# EAGLE schematic T-Bone_V101 (EAGLE 6.5.0)

## Sheet 1 of 10
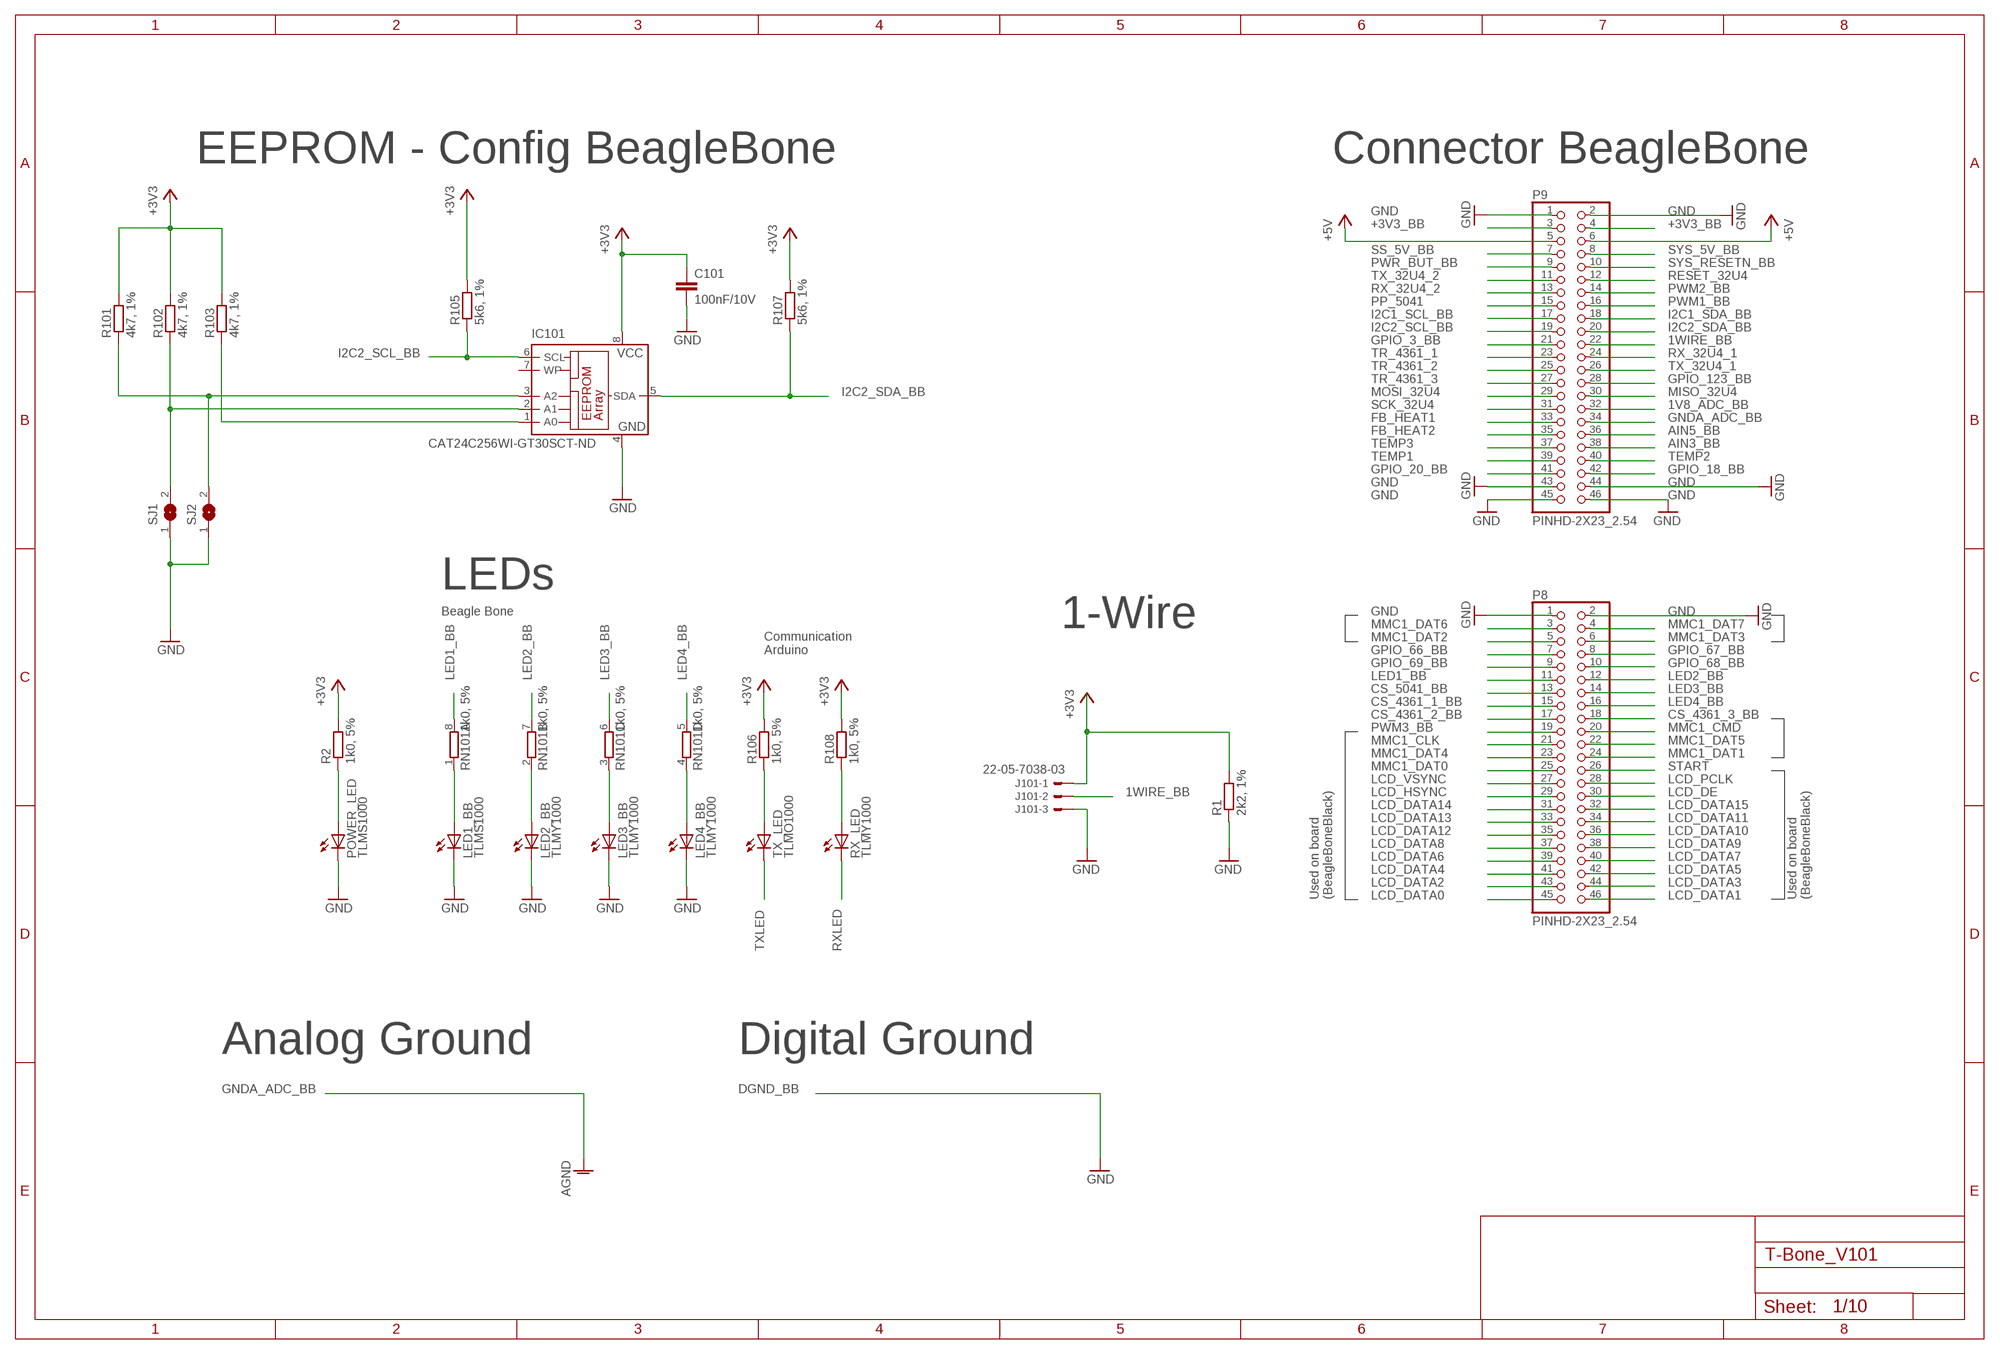
[diagram p0: schematic, sheet 1]

### Parts
C101  100nF/10V  C-EUC0402K  [C0402K]
IC101  CAT24C256WI-GT30SCT-ND  24LC256SN  [SO-08]
J101  22-05-7038-03  [7395-03]
LED1_BB  TLMS1000  LEDCHIP-LED0603  [CHIP-LED0603]
LED2_BB  TLMY1000  LEDCHIP-LED0603  [CHIP-LED0603]
LED3_BB  TLMY1000  LEDCHIP-LED0603  [CHIP-LED0603]
LED4_BB  TLMY1000  LEDCHIP-LED0603  [CHIP-LED0603]
P8  PINHD-2X23_2.54  [2X23]
P9  PINHD-2X23_2.54  [2X23]
POWER_LED  TLMS1000  LEDCHIP-LED0603  [CHIP-LED0603]
R1  2k2, 1%  R-EU_R0603  [R0603]
R2  1k0, 5%  R-EU_R0402  [R0402]
R101  4k7, 1%  R-EU_R0402  [R0402]
R102  4k7, 1%  R-EU_R0402  [R0402]
R103  4k7, 1%  R-EU_R0402  [R0402]
R105  5k6, 1%  R-EU_R0402  [R0402]
R106  1k0, 5%  R-EU_R0402  [R0402]
R107  5k6, 1%  R-EU_R0402  [R0402]
R108  1k0, 5%  R-EU_R0402  [R0402]
RN101  1k0, 5%  4R-NYC124  [YC124]
RX_LED  TLMY1000  LEDCHIP-LED0603  [CHIP-LED0603]
SJ1  SJ  [SJ]
SJ2  SJ  [SJ]
TX_LED  TLMO1000  LEDCHIP-LED0603  [CHIP-LED0603]

### Nets
1V8_ADC_BB: P9.32 ; also sheet 3,10
1WIRE_BB: J101.2 P9.22
+3V3: C101.1 IC101.8(VCC) J101.1 R1.2 R2.2 R101.2 R102.2 R103.2 R105.2 R106.2 R107.2 R108.2 ; also sheet 2,3,4,5,6,7,8,9
+3V3_BB: P9.3 P9.4
+5V: P9.5 P9.6 ; also sheet 2,5,6,7
AIN3_BB: P9.38
AIN5_BB: P9.36
CS_4361_1_BB: P8.15 ; also sheet 8
CS_4361_2_BB: P8.17 ; also sheet 8
CS_4361_3_BB: P8.18 ; also sheet 8
CS_5041_BB: P8.13 ; also sheet 8
FB_HEAT1: P9.33 ; also sheet 3,8
FB_HEAT2: P9.35 ; also sheet 3,8
GND: C101.2 IC101.4(GND) J101.3 LED1_BB.C LED2_BB.C LED3_BB.C LED4_BB.C P8.1 P8.2 P9.1 P9.2 P9.43 P9.44 P9.45 P9.46 POWER_LED.C R1.1 SJ1.1 SJ2.1 ; also sheet 2,3,4,5,6,7,8,9,10
GNDA_ADC_BB: P9.34 ; supply symbol labelled AGND
GPIO_3_BB: P9.21
GPIO_18_BB: P9.42
GPIO_20_BB: P9.41
GPIO_66_BB: P8.7
GPIO_67_BB: P8.8
GPIO_68_BB: P8.10
GPIO_69_BB: P8.9
GPIO_123_BB: P9.28
I2C1_SCL_BB: P9.17
I2C1_SDA_BB: P9.18
I2C2_SCL_BB: IC101.6(SCL) P9.19 R105.1
I2C2_SDA_BB: IC101.5(SDA) P9.20 R107.1
LCD_DATA0: P8.45
LCD_DATA1: P8.46
LCD_DATA2: P8.43
LCD_DATA3: P8.44
LCD_DATA4: P8.41
LCD_DATA5: P8.42
LCD_DATA6: P8.39
LCD_DATA7: P8.40
LCD_DATA8: P8.37
LCD_DATA9: P8.38
LCD_DATA10: P8.36
LCD_DATA11: P8.34
LCD_DATA12: P8.35
LCD_DATA13: P8.33
LCD_DATA14: P8.31
LCD_DATA15: P8.32
LCD_DE: P8.30
LCD_HSYNC: P8.29
LCD_PCLK: P8.28
LCD_VSYNC: P8.27
LED1_BB: P8.11 RN101.8
LED2_BB: P8.12 RN101.7
LED3_BB: P8.14 RN101.6
LED4_BB: P8.16 RN101.5
MISO_32U4: P9.30 ; also sheet 3,4,5,6,7
MMC1_CLK: P8.21
MMC1_CMD: P8.20
MMC1_DAT0: P8.25
MMC1_DAT1: P8.24
MMC1_DAT2: P8.5
MMC1_DAT3: P8.6
MMC1_DAT4: P8.23
MMC1_DAT5: P8.22
MMC1_DAT6: P8.3
MMC1_DAT7: P8.4
MOSI_32U4: P9.29 ; also sheet 3,4,5,6,7
N$28: R106.1 TX_LED.A
N$33: R108.1 RX_LED.A
N$47: POWER_LED.A R2.1
N$88: LED1_BB.A RN101.1
N$90: LED2_BB.A RN101.2
N$91: LED3_BB.A RN101.3
N$92: LED4_BB.A RN101.4
N$107: IC101.2(A1) R102.1 SJ1.2
N$108: IC101.1(A0) R103.1
N$109: IC101.3(A2) R101.1 SJ2.2
PP_5041: P9.15 ; also sheet 4
PWM1_BB: P9.16 ; also sheet 8
PWM2_BB: P9.14 ; also sheet 8
PWM3_BB: P8.19 ; also sheet 8
PWR_BUT_BB: P9.9
RESET_32U4: P9.12 ; also sheet 3
RX_32U4_1: P9.24 ; also sheet 3
RX_32U4_2: P9.13 ; also sheet 3
RXLED: RX_LED.C ; also sheet 3
SCK_32U4: P9.31 ; also sheet 3,4,5,6,7
SS_5V_BB: P9.7
START: P8.26 ; also sheet 3,5,6,7
SYS_5V_BB: P9.8
SYS_RESETN_BB: P9.10
TEMP1: P9.39 ; also sheet 3,10
TEMP2: P9.40 ; also sheet 3,10
TEMP3: P9.37 ; also sheet 3,10
TR_4361_1: P9.23 ; also sheet 5
TR_4361_2: P9.25 ; also sheet 6
TR_4361_3: P9.27 ; also sheet 7
TX_32U4_1: P9.26 ; also sheet 3
TX_32U4_2: P9.11 ; also sheet 3
TXLED: TX_LED.C ; also sheet 3
Unconnected: IC101.7(WP)

### Notes on the sheet
- EEPROM - Config BeagleBone | Connector BeagleBone
- LEDs
- Beagle Bone
- 1-Wire
- Communication
  Arduino
- Used on board
  (BeagleBoneBlack)
- Used on board
  (BeagleBoneBlack)
- Analog Ground | Digital Ground

## Sheet 2 of 10
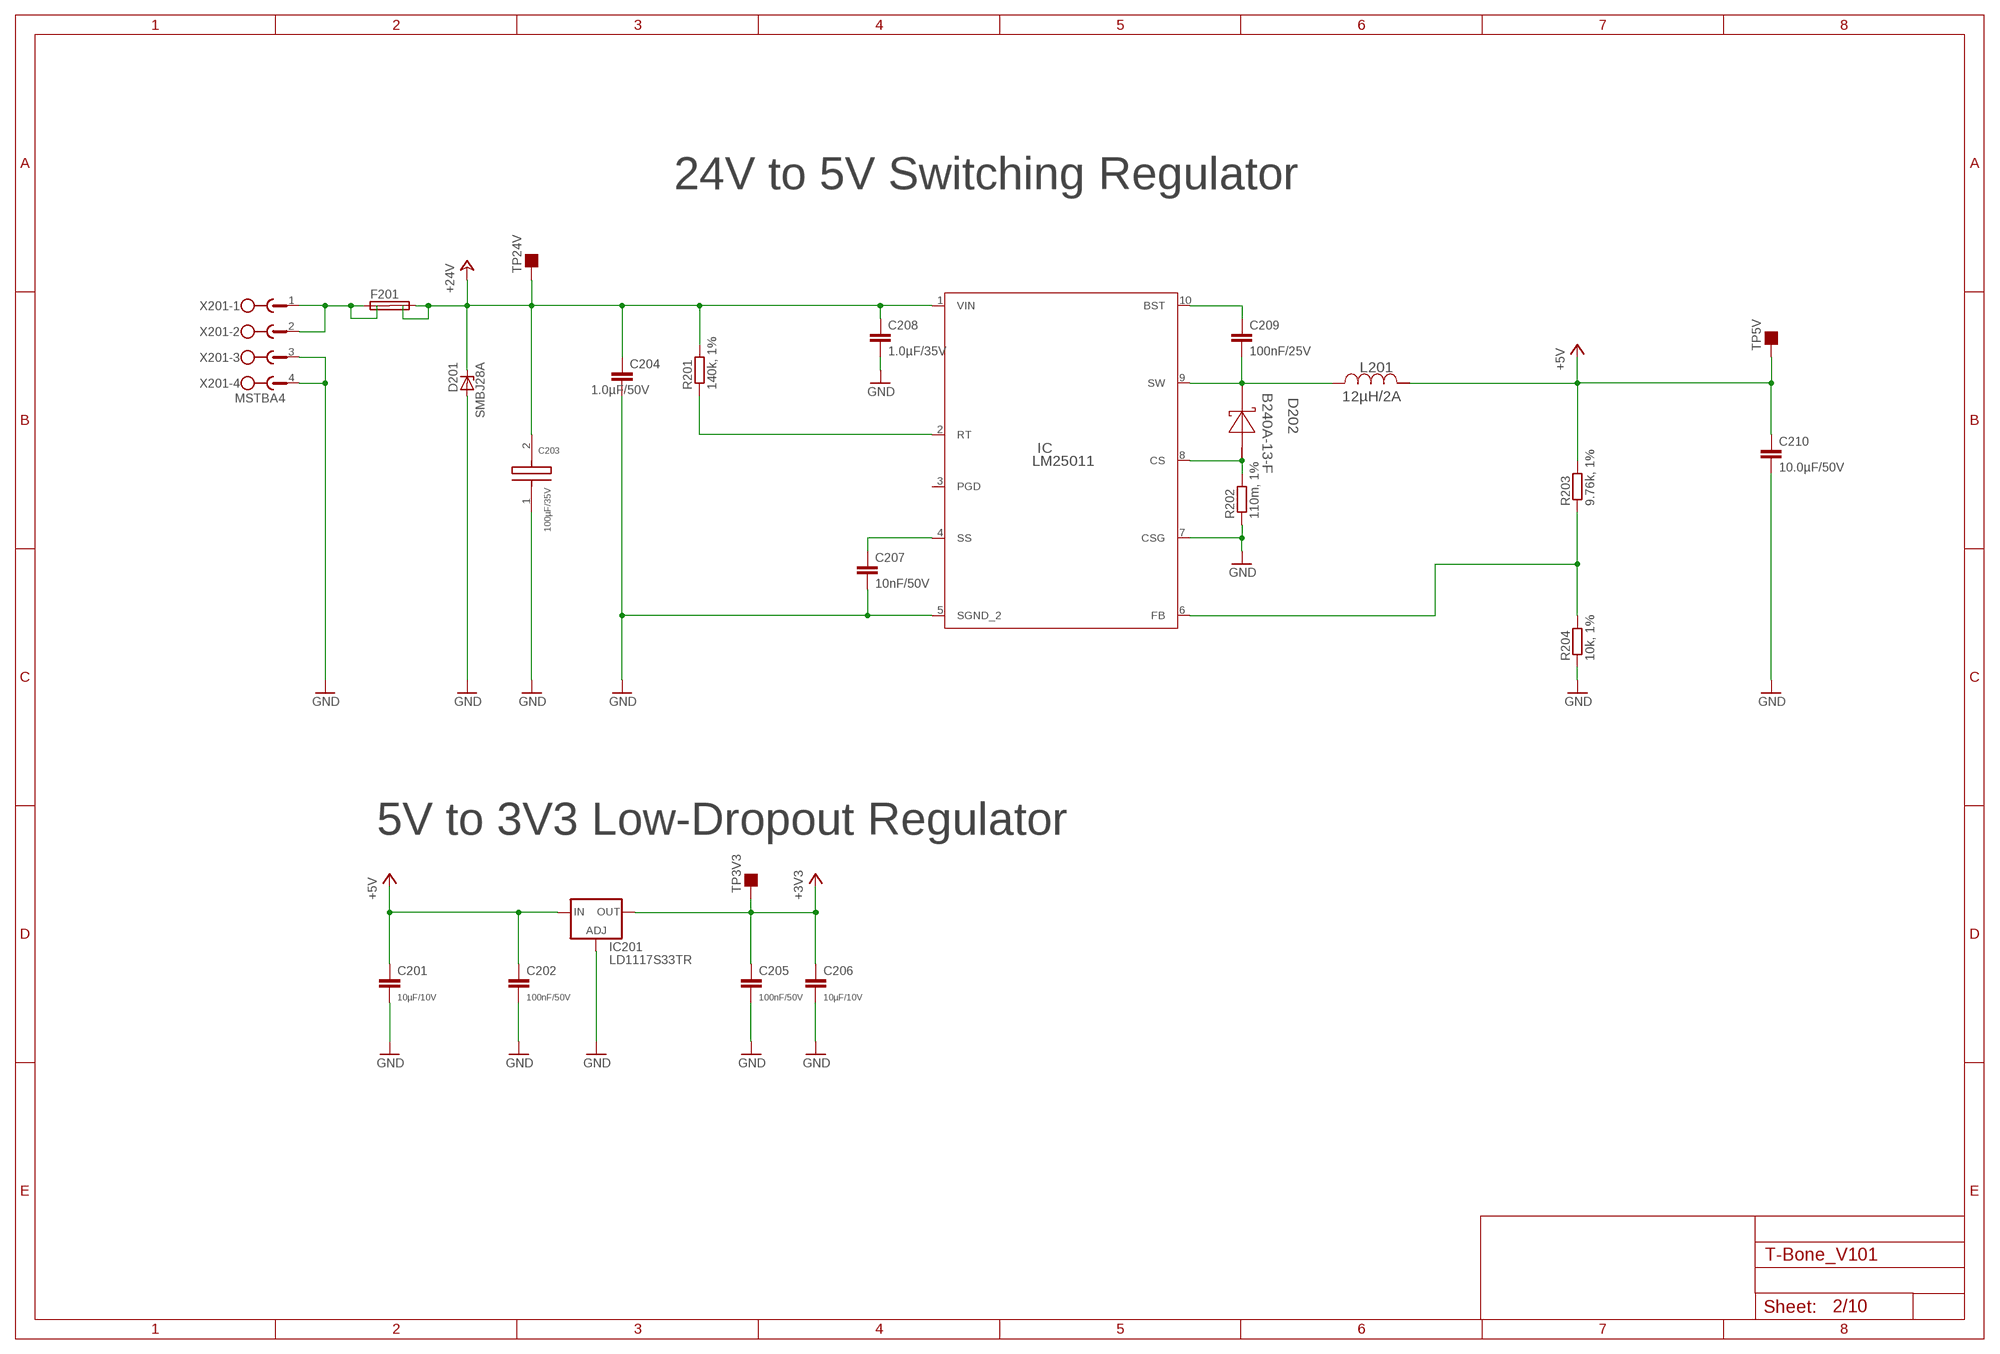
[diagram p1: schematic, sheet 2]

### Parts
C201  10µF/10V  C-EUC0805K  [C0805K]
C202  100nF/50V  C-EUC0603K  [C0603K]
C203  100µF/35V  D8F  [F]
C204  1.0µF/50V  C-EUC1206K  [C1206K]
C205  100nF/50V  C-EUC0603K  [C0603K]
C206  10µF/10V  C-EUC0805K  [C0805K]
C207  10nF/50V  C-EUC0805K  [C0805K]
C208  1.0µF/35V  C-EUC0805K  [C0805K]
C209  100nF/25V  C-EUC0805K  [C0805K]
C210  10.0µF/50V  C-EUC0603K  [C0603K]
D201  SMBJ28A  ZENER-DIODESMB  [SMB]
D202  B240A-13-F  [SMA]
F201  SHK20Q  [SHK20Q]
IC  LM25011  LM25011MY/NOPB  [MUC10A]
IC201  LD1117S33TR  LD117AS33TR  [SOT223]
L201  12µH/2A  SDR0805-120ML  [SDR0805]
R201  140k, 1%  R-EU_R0402  [R0402]
R202  110m, 1%  R-EU_R1210  [R1210]
R203  9.76k, 1%  R-EU_R0402  [R0402]
R204  10k, 1%  R-EU_R0402  [R0402]
TP3V3  TP  [TP]
TP5V  TP  [TP]
TP24V  TP  [TP]
X201  MSTBA4  [MSTBA4]

### Nets
24V_INPUT: F201.1A F201.1B X201.1 X201.2
+3V3: C205.1 C206.1 IC201.4(OUT) TP3V3.P$1 ; also sheet 1,3,4,5,6,7,8,9
+5V: C201.1 C202.1 C210.1 IC201.3(IN) L201.1 R203.2 TP5V.P$1 ; also sheet 1,5,6,7
+24V: C203.2 C204.1 C208.1 D201.C F201.2A F201.2B IC.1(VIN) R201.2 TP24V.P$1 ; also sheet 4,5,6,7,8
GND: C201.2 C202.2 C203.1 C204.2 C205.2 C206.2 C207.2 C208.2 C210.2 D201.A IC201.1(ADJ) IC.5(SGND_2) IC.7(CSG) R202.1 R204.1 X201.3 X201.4 ; also sheet 1,3,4,5,6,7,8,9,10
N$23: D202.2(A) IC.8(CS) R202.2
N$24: C209.2 D202.1(K) IC.9(SW) L201.2
N$85: IC.6(FB) R203.1 R204.2
N$103: C209.1 IC.10(BST)
N$104: C207.1 IC.4(SS)
N$105: IC.2(RT) R201.1
Unconnected: IC.3(PGD)

### Notes on the sheet
- 24V to 5V Switching Regulator
- 5V to 3V3 Low-Dropout Regulator

## Sheet 3 of 10
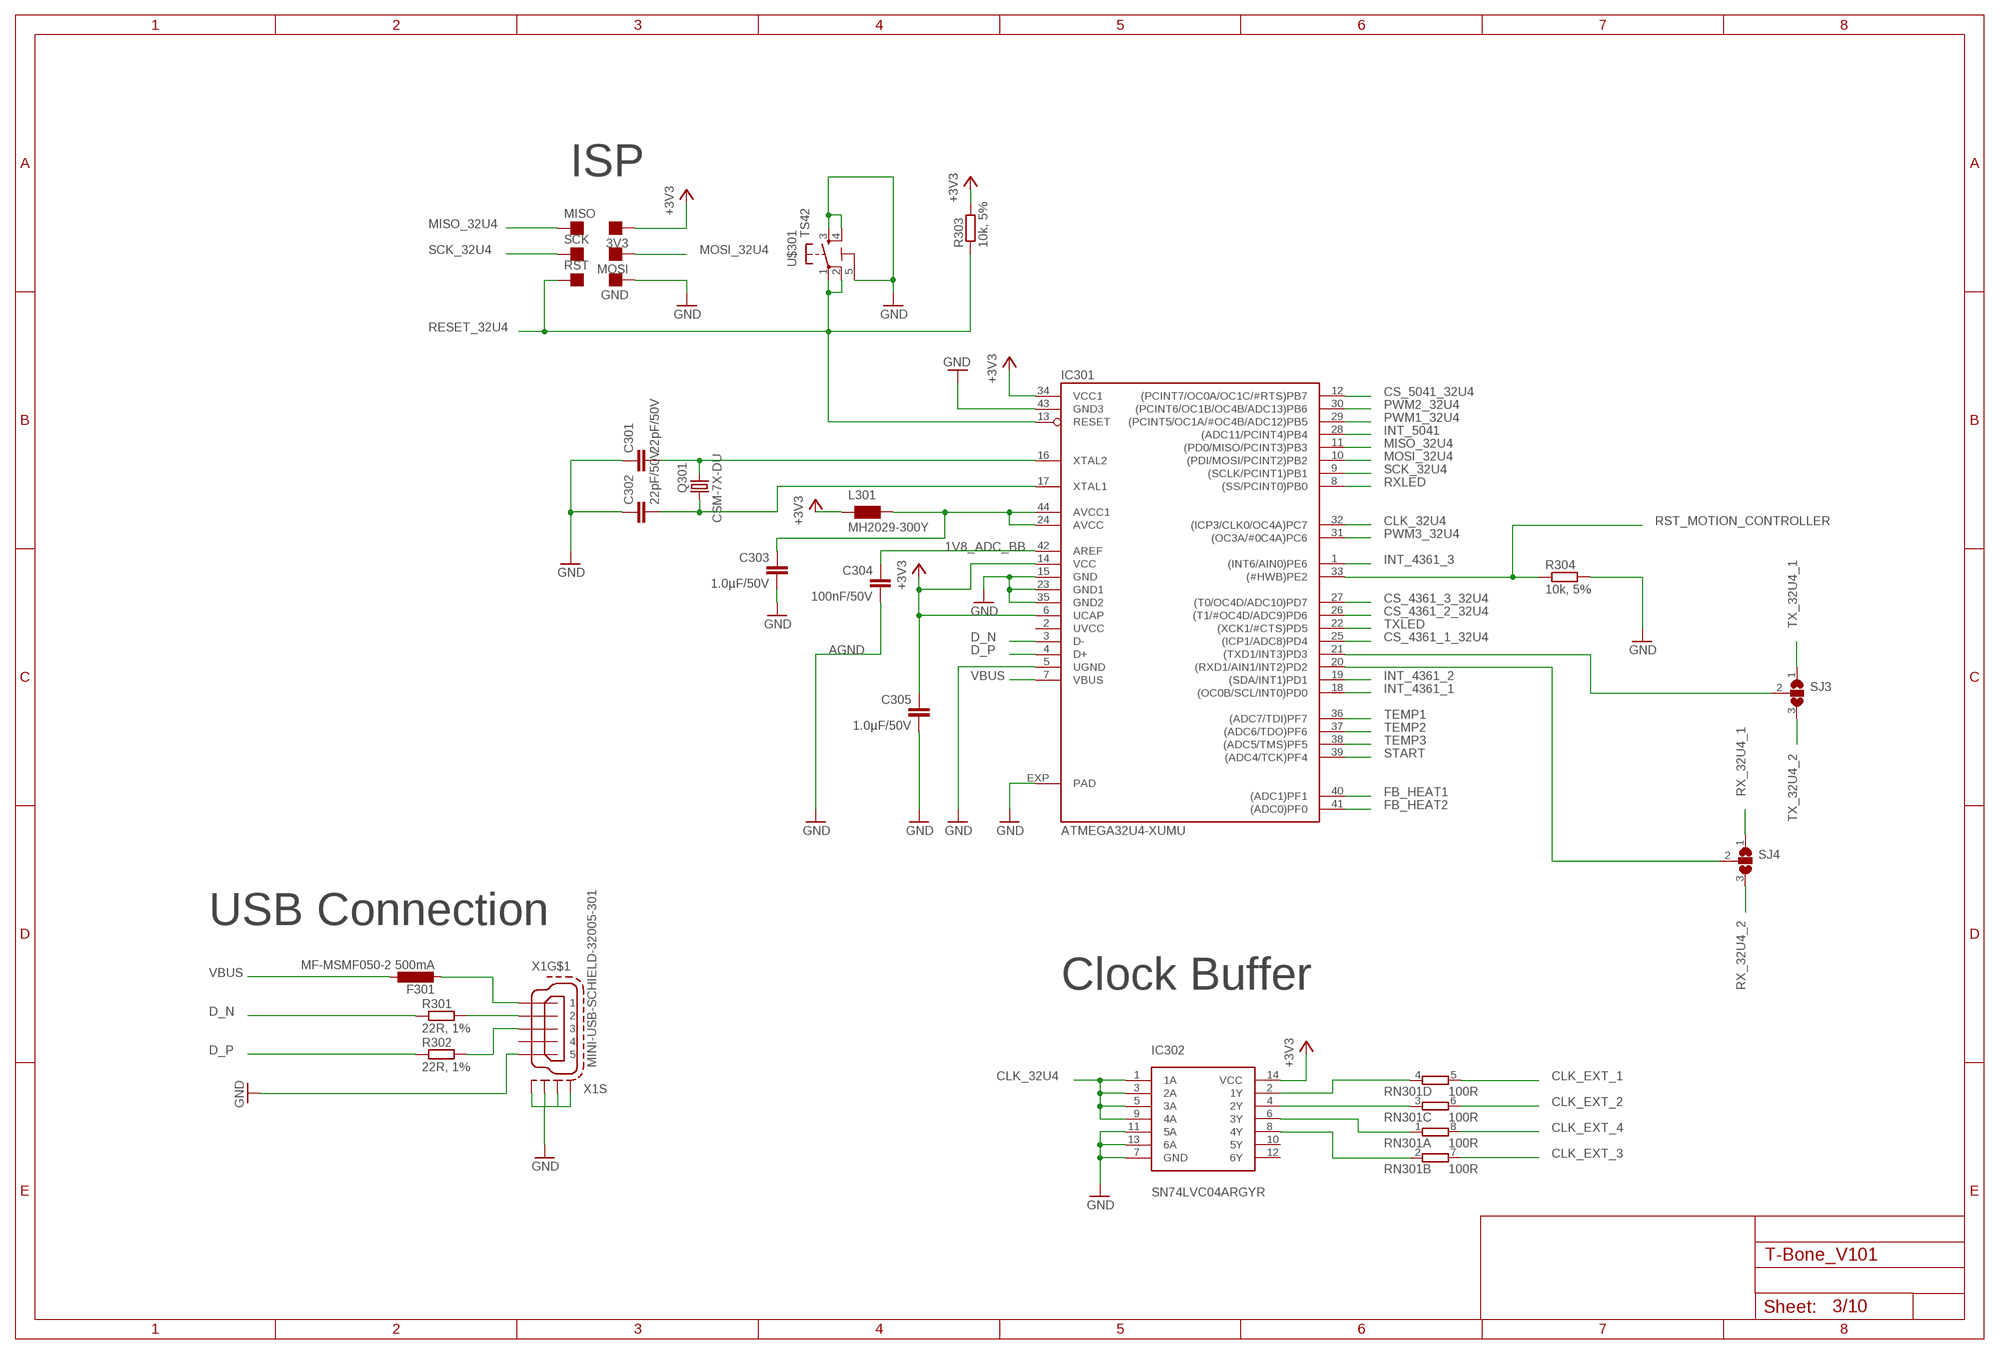
[diagram p2: schematic, sheet 3]

### Parts
3V3  TP  [TP]
C301  22pF/50V  C-EUC0603K  [C0603K]
C302  22pF/50V  C-EUC0603K  [C0603K]
C303  1.0µF/50V  C-EUC0603K  [C0603K]
C304  100nF/50V  C-EUC0603K  [C0603K]
C305  1.0µF/50V  C-EUC0603K  [C0603K]
F301  MF-MSMF050-2 500mA  L-EUL1812  [L1812]
GND  TP  [TP]
IC301  ATMEGA32U4-XUMU  [QFN44ML7X7]
IC302  SN74LVC04ARGYR  74LVC04A  [14-VFQFN]
L301  MH2029-300Y  WE-CBF_0805  [0805]
MISO  TP  [TP]
MOSI  TP  [TP]
Q301  CSM-7X-DU  [CSM-7X-DU]
R301  22R, 1%  R-EU_R0402  [R0402]
R302  22R, 1%  R-EU_R0402  [R0402]
R303  10k, 5%  R-EU_R0603  [R0603]
R304  10k, 5%  R-EU_R0402  [R0402]
RN301  100R  4R-NYC124  [YC124]
RST  TP  [TP]
SCK  TP  [TP]
SJ3  SJ2W  [SJ_2]
SJ4  SJ2W  [SJ_2]
U$301  TS42  [TS42]
X1  MINI-USB-SCHIELD-32005-301  [32005-301]

### Nets
1V8_ADC_BB: C304.1 IC301.42(AREF) ; also sheet 1,10
+3V3: 3V3.P$1 C305.1 IC301.6(UCAP) IC301.14(VCC) IC301.34(VCC1) IC302.14(VCC) L301.1 R303.2 ; also sheet 1,2,4,5,6,7,8,9
AGND: C304.2 ; supply symbol labelled GND
CLK_32U4: IC301.32((ICP3/CLK0/OC4A)PC7) IC302.1(1A) IC302.3(2A) IC302.5(3A) IC302.9(4A)
CLK_EXT_1: RN301.5 ; also sheet 4
CLK_EXT_2: RN301.6 ; also sheet 5
CLK_EXT_3: RN301.7 ; also sheet 6
CLK_EXT_4: RN301.8 ; also sheet 7
CS_4361_1_32U4: IC301.25((ICP1/ADC8)PD4) ; also sheet 8
CS_4361_2_32U4: IC301.26((T1/#OC4D/ADC9)PD6) ; also sheet 8
CS_4361_3_32U4: IC301.27((T0/OC4D/ADC10)PD7) ; also sheet 8
CS_5041_32U4: IC301.12((PCINT7/OC0A/OC1C/#RTS)PB7) ; also sheet 8
D_N: IC301.3(D-) R301.1
D_P: IC301.4(D+) R302.1
FB_HEAT1: IC301.40((ADC1)PF1) ; also sheet 1,8
FB_HEAT2: IC301.41((ADC0)PF0) ; also sheet 1,8
GND: C301.1 C302.1 C303.2 C305.2 GND.P$1 IC301.5(UGND) IC301.15(GND) IC301.23(GND1) IC301.35(GND2) IC301.43(GND3) IC301.EXP(PAD) IC302.7(GND) IC302.11(5A) IC302.13(6A) R304.2 U$301.3 U$301.4 U$301.5(5-GND) X1.5 X1.M1(S:S1) X1.M2(S:S2) X1.M3(S:S3) X1.M4(S:S4) ; also sheet 1,2,4,5,6,7,8,9,10
INT_4361_1: IC301.18((OC0B/SCL/INT0)PD0) ; also sheet 5
INT_4361_2: IC301.19((SDA/INT1)PD1) ; also sheet 6
INT_4361_3: IC301.1((INT6/AIN0)PE6) ; also sheet 7
INT_5041: IC301.28((ADC11/PCINT4)PB4) ; also sheet 4
MISO_32U4: IC301.11((PD0/MISO/PCINT3)PB3) MISO.P$1 ; also sheet 1,4,5,6,7
MOSI_32U4: IC301.10((PDI/MOSI/PCINT2)PB2) MOSI.P$1 ; also sheet 1,4,5,6,7
N$13: IC301.21((TXD1/INT3)PD3) SJ3.2
N$14: R302.2 X1.3
N$15: R301.2 X1.2
N$16: IC302.6(3Y) RN301.1
N$17: IC302.8(4Y) RN301.2
N$18: IC302.2(1Y) RN301.4
N$22: C303.1 IC301.24(AVCC) IC301.44(AVCC1) L301.2
N$25: IC302.4(2Y) RN301.3
N$27: F301.2 X1.1
N$29: C301.2 IC301.16(XTAL2) Q301.2
N$30: C302.2 IC301.17(XTAL1) Q301.1
N$95: IC301.20((RXD1/AIN1/INT2)PD2) SJ4.2
PWM1_32U4: IC301.29((PCINT5/OC1A/#OC4B/ADC12)PB5) ; also sheet 8
PWM2_32U4: IC301.30((PCINT6/OC1B/OC4B/ADC13)PB6) ; also sheet 8
PWM3_32U4: IC301.31((OC3A/#0C4A)PC6) ; also sheet 8
RESET_32U4: IC301.13(RESET) R303.1 RST.P$1 U$301.1 U$301.2 ; also sheet 1
RST_MOTION_CONTROLLER: IC301.33((#HWB)PE2) R304.1 ; also sheet 5,6,7
RX_32U4_1: SJ4.1 ; also sheet 1
RX_32U4_2: SJ4.3 ; also sheet 1
RXLED: IC301.8((SS/PCINT0)PB0) ; also sheet 1
SCK_32U4: IC301.9((SCLK/PCINT1)PB1) SCK.P$1 ; also sheet 1,4,5,6,7
START: IC301.39((ADC4/TCK)PF4) ; also sheet 1,5,6,7
TEMP1: IC301.36((ADC7/TDI)PF7) ; also sheet 1,10
TEMP2: IC301.37((ADC6/TDO)PF6) ; also sheet 1,10
TEMP3: IC301.38((ADC5/TMS)PF5) ; also sheet 1,10
TX_32U4_1: SJ3.1 ; also sheet 1
TX_32U4_2: SJ3.3 ; also sheet 1
TXLED: IC301.22((XCK1/#CTS)PD5) ; also sheet 1
VBUS: F301.1 IC301.7(VBUS)
Unconnected: IC302.10(5Y) IC302.12(6Y) X1.4

### Notes on the sheet
- ISP
- USB Connection
- Clock Buffer

## Sheet 4 of 10
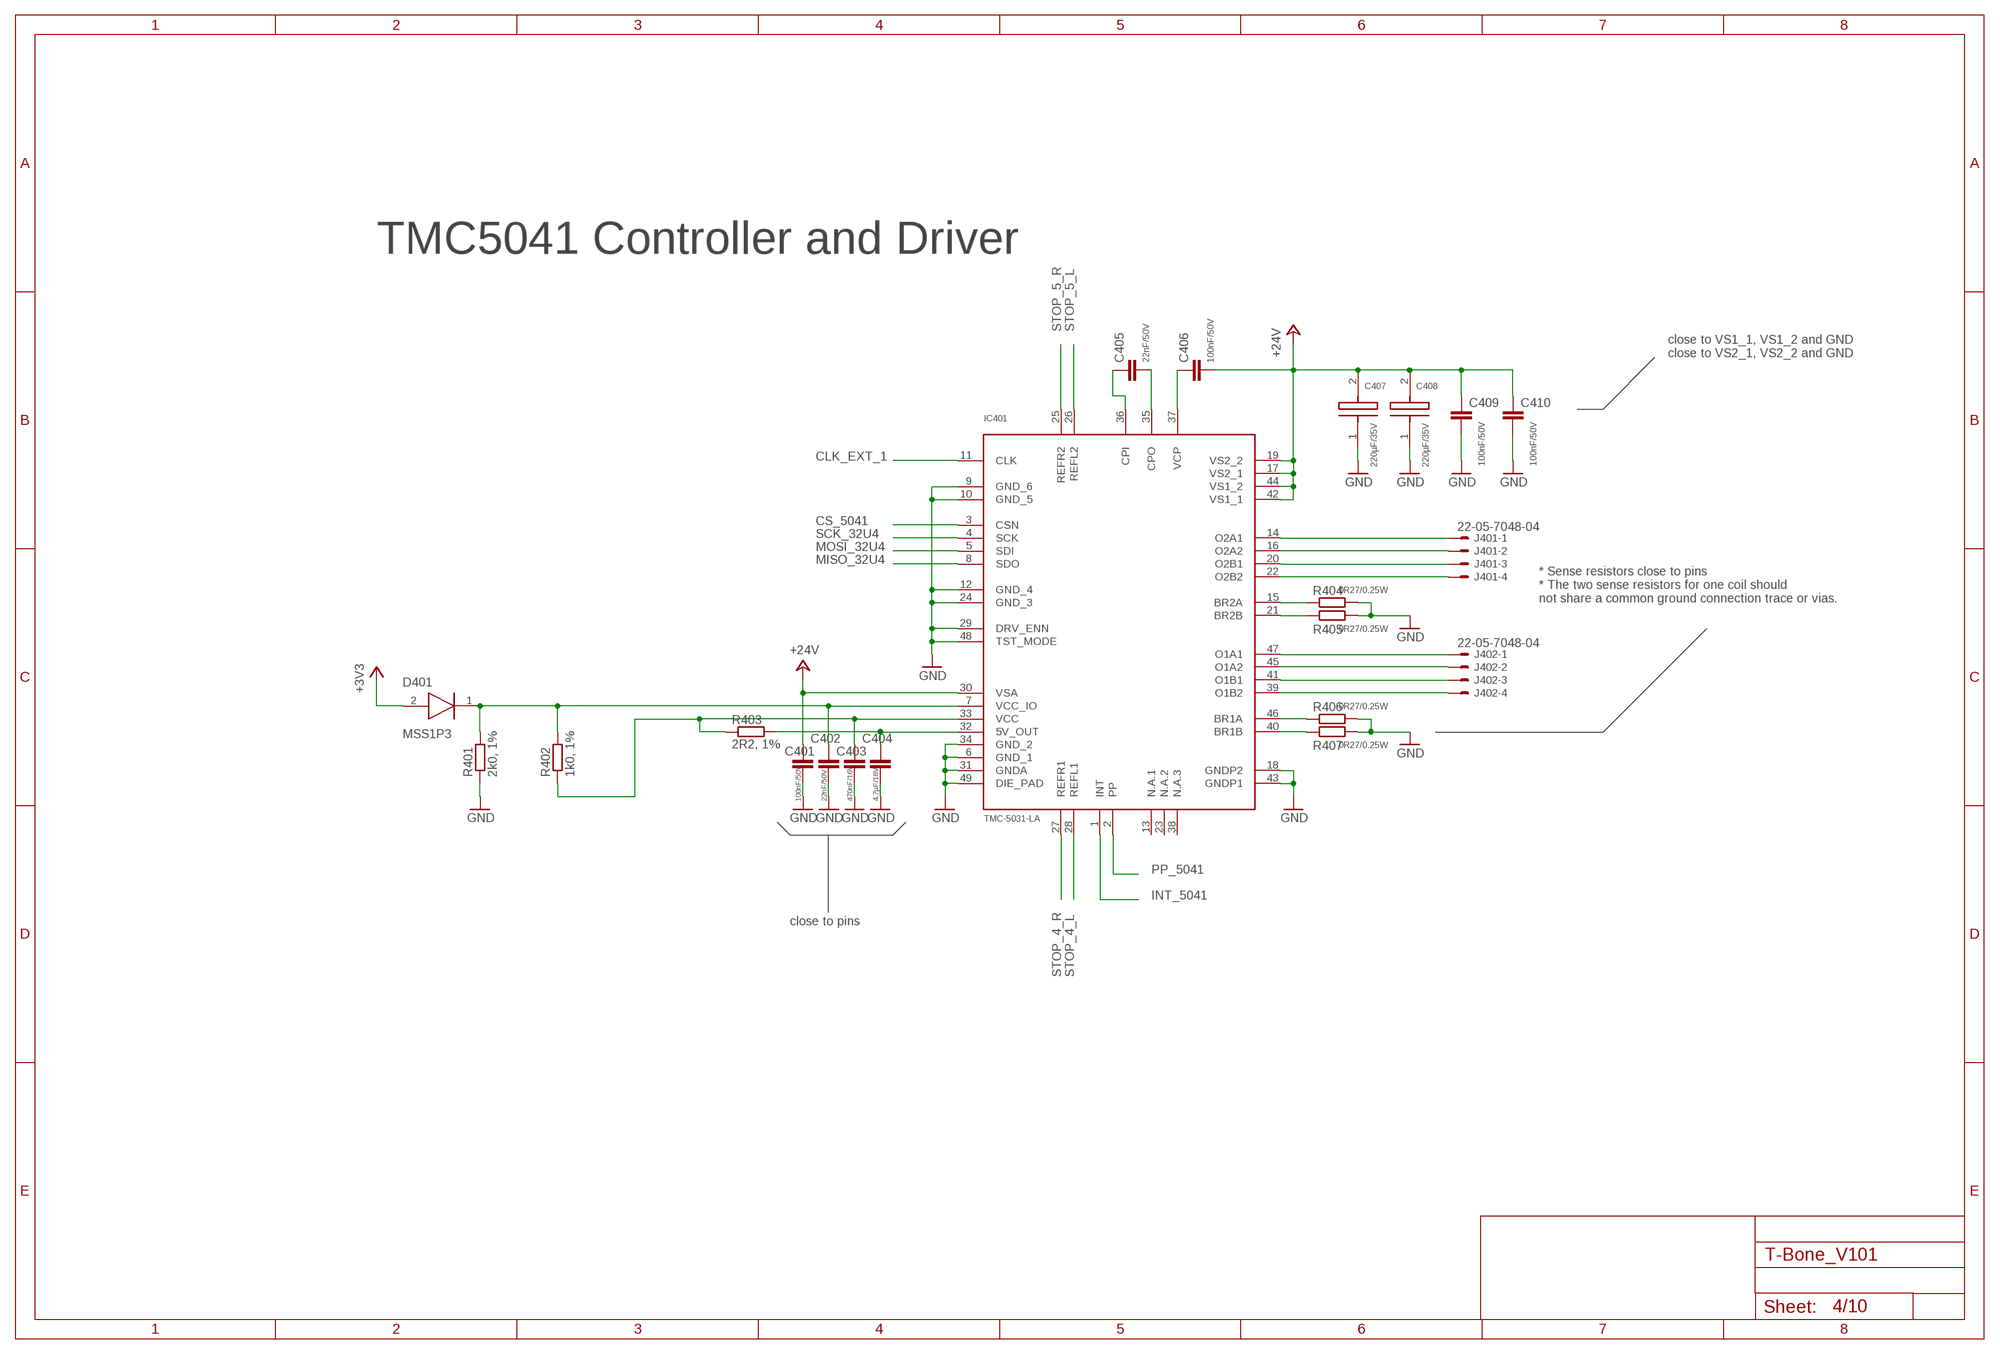
[diagram p3: schematic, sheet 4]

### Parts
C401  100nF/50V  C-EUC0603K  [C0603K]
C402  22nF/50V  C-EUC0603K  [C0603K]
C403  470nF/16V  C-EUC0603K  [C0603K]
C404  4.7µF/16V  C-EUC0603K  [C0603K]
C405  22nF/50V  C-EUC0603K  [C0603K]
C406  100nF/50V  C-EUC0603K  [C0603K]
C407  220µF/35V  D8F  [F]
C408  220µF/35V  D8F  [F]
C409  100nF/50V  C-EUC0603K  [C0603K]
C410  100nF/50V  C-EUC0603K  [C0603K]
D401  MSS1P3  MSS1P6  [MSS1PX]
IC401  TMC-5031-LA  [QFN48]
J401  22-05-7048-04  [7395-04]
J402  22-05-7048-04  [7395-04]
R401  2k0, 1%  R-EU_R0603  [R0603]
R402  1k0, 1%  R-EU_R0603  [R0603]
R403  2R2, 1%  R-EU_R0603  [R0603]
R404  0R27/0.25W  R-EU_R1206  [R1206]
R405  0R27/0.25W  R-EU_R1206  [R1206]
R406  0R27/0.25W  R-EU_R1206  [R1206]
R407  0R27/0.25W  R-EU_R1206  [R1206]

### Nets
5031_O1A1: IC401.47(O1A1) J402.1
5031_O1A2: IC401.45(O1A2) J402.2
5031_O1B1: IC401.41(O1B1) J402.3
5031_O1B2: IC401.39(O1B2) J402.4
5031_O2A1: IC401.14(O2A1) J401.1
5031_O2A2: IC401.16(O2A2) J401.2
5031_O2B1: IC401.20(O2B1) J401.3
5031_O2B2: IC401.22(O2B2) J401.4
+3V3: D401.2(ANODE) ; also sheet 1,2,3,5,6,7,8,9
+24V: C401.1 C406.2 C407.2 C408.2 C409.1 C410.1 IC401.17(VS2_1) IC401.19(VS2_2) IC401.30(VSA) IC401.42(VS1_1) IC401.44(VS1_2) ; also sheet 2,5,6,7,8
CLK_EXT_1: IC401.11(CLK) ; also sheet 3
CS_5041: IC401.3(CSN) ; also sheet 8
GND: C401.2 C402.2 C403.2 C404.2 C407.1 C408.1 C409.2 C410.2 IC401.6(GND_1) IC401.9(GND_6) IC401.10(GND_5) IC401.12(GND_4) IC401.18(GNDP2) IC401.24(GND_3) IC401.29(DRV_ENN) IC401.31(GNDA) IC401.34(GND_2) IC401.43(GNDP1) IC401.48(TST_MODE) IC401.49(DIE_PAD) R401.1 R404.2 R405.2 R406.2 R407.2 ; also sheet 1,2,3,5,6,7,8,9,10
INT_5041: IC401.1(INT) ; also sheet 3
MISO_32U4: IC401.8(SDO) ; also sheet 1,3,5,6,7
MOSI_32U4: IC401.5(SDI) ; also sheet 1,3,5,6,7
N$1: C403.1 IC401.33(VCC) R402.1 R403.1
N$2: C405.2 IC401.35(CPO)
N$3: C405.1 IC401.36(CPI)
N$4: C406.1 IC401.37(VCP)
N$5: C404.1 IC401.32(5V_OUT) R403.2
N$6: IC401.21(BR2B) R405.1
N$7: IC401.15(BR2A) R404.1
N$8: IC401.40(BR1B) R407.1
N$9: IC401.46(BR1A) R406.1
N$57: C402.1 D401.1(KATHODE) IC401.7(VCC_IO) R401.2 R402.2
PP_5041: IC401.2(PP) ; also sheet 1
SCK_32U4: IC401.4(SCK) ; also sheet 1,3,5,6,7
STOP_4_L: IC401.28(REFL1) ; also sheet 9
STOP_4_R: IC401.27(REFR1) ; also sheet 9
STOP_5_L: IC401.26(REFL2) ; also sheet 9
STOP_5_R: IC401.25(REFR2) ; also sheet 9
Unconnected: IC401.13(N.A.1) IC401.23(N.A.2) IC401.38(N.A.3)

### Notes on the sheet
- TMC5041 Controller and Driver
- close to VS1_1, VS1_2 and GND
  close to VS2_1, VS2_2 and GND
- * Sense resistors close to pins
  * The two sense resistors for one coil should
  not share a common ground connection trace or vias.
- close to pins

## Sheet 5 of 10
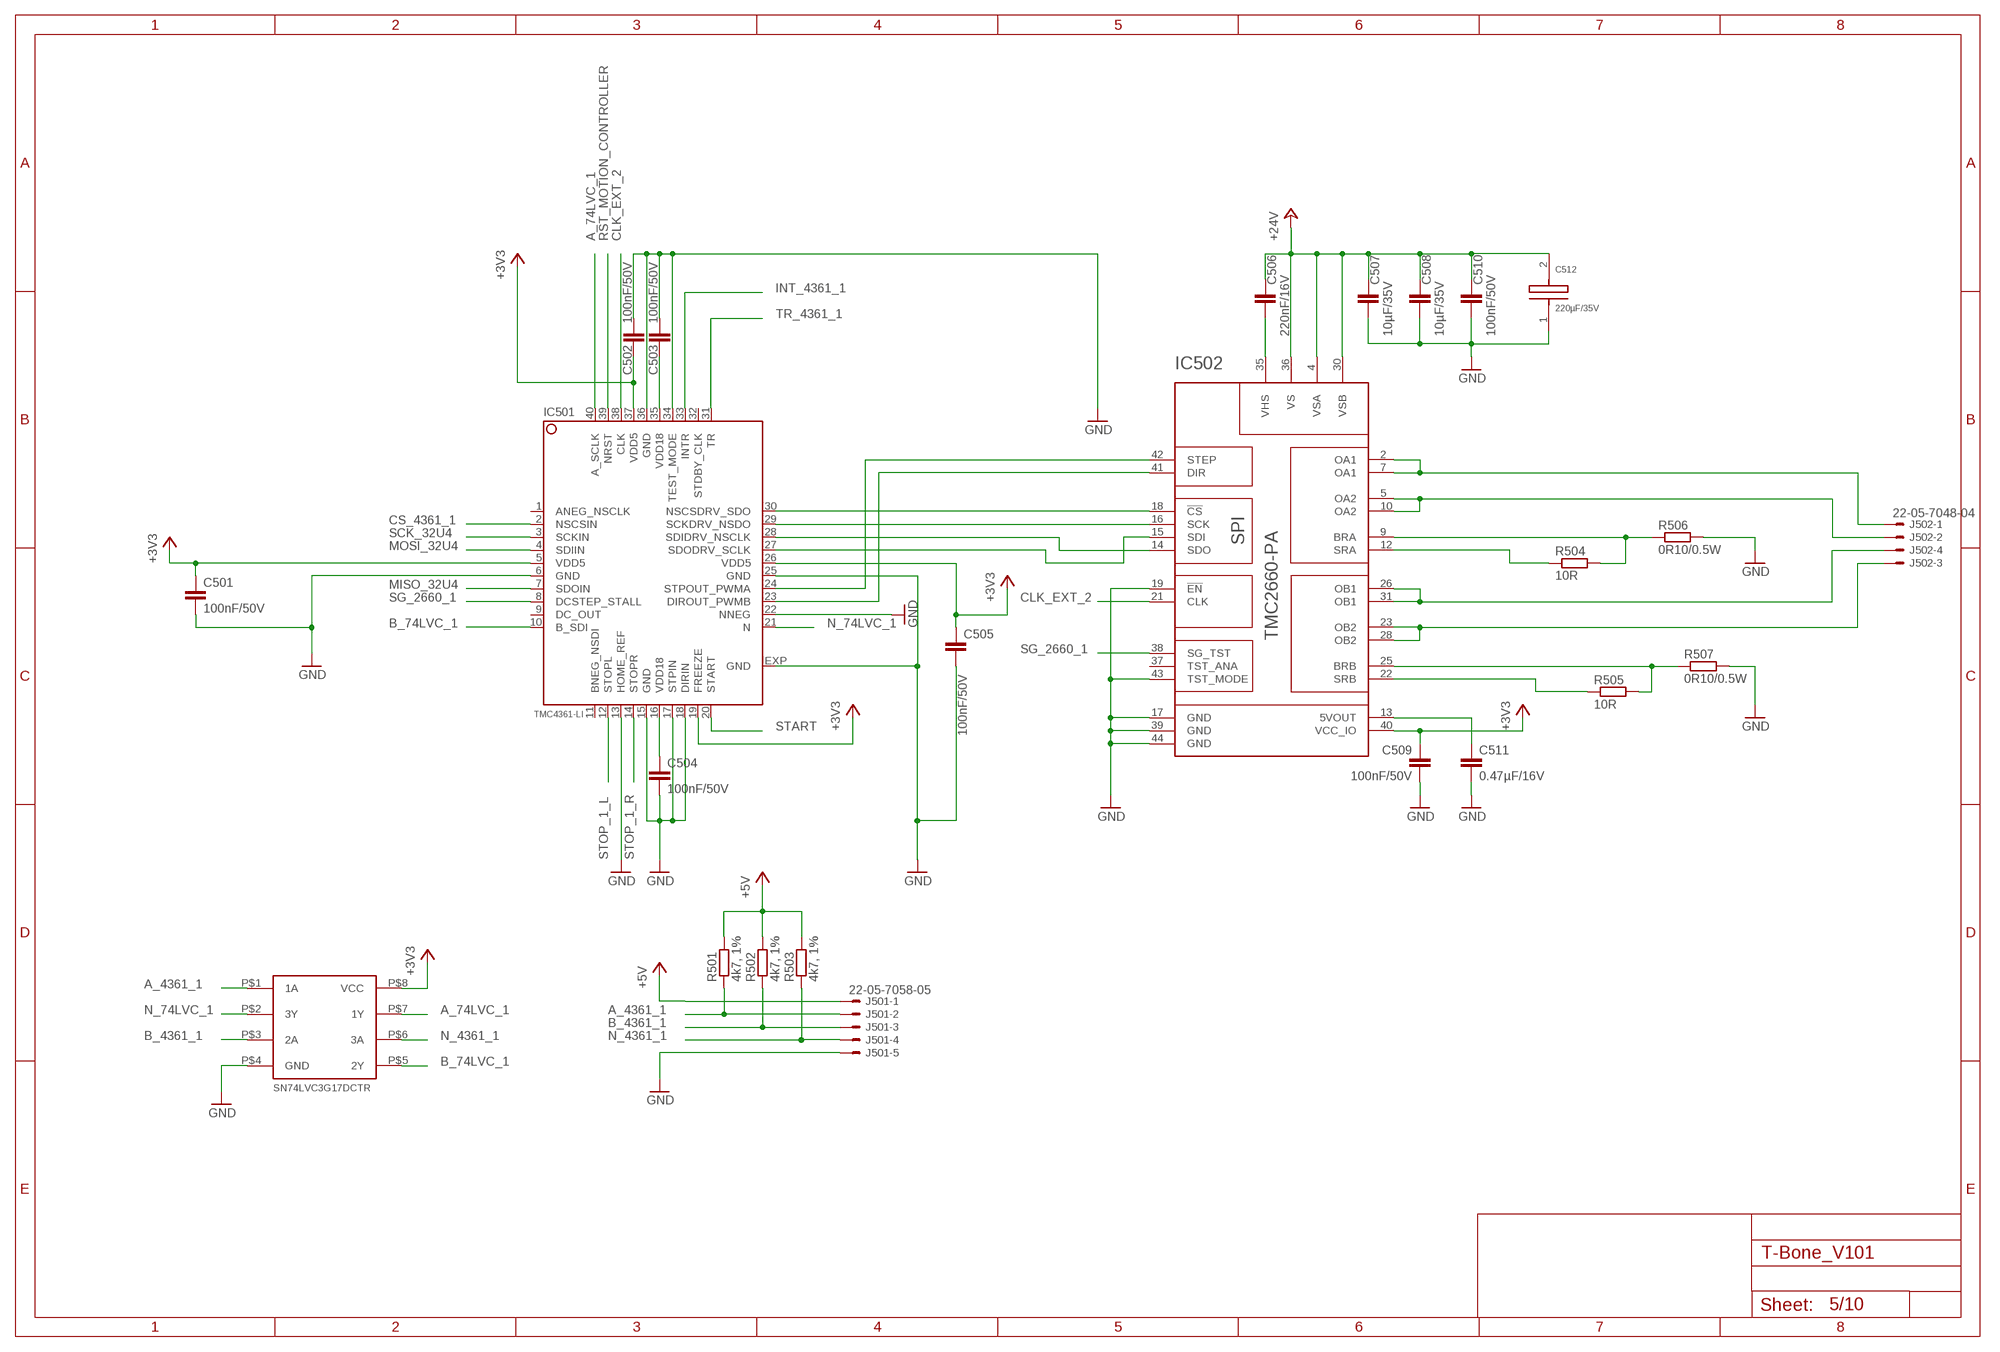
[diagram p4: schematic, sheet 5]

### Parts
C501  100nF/50V  C-EUC0603K  [C0603K]
C502  100nF/50V  C-EUC0603K  [C0603K]
C503  100nF/50V  C-EUC0603K  [C0603K]
C504  100nF/50V  C-EUC0603K  [C0603K]
C505  100nF/50V  C-EUC0603K  [C0603K]
C506  220nF/16V  C-EUC0603K  [C0603K]
C507  10µF/35V  C-EUC1210K  [C1210K]
C508  10µF/35V  C-EUC1210K  [C1210K]
C509  100nF/50V  C-EUC0603K  [C0603K]
C510  100nF/50V  C-EUC0603K  [C0603K]
C511  0.47µF/16V  C-EUC0603K  [C0603K]
C512  220µF/35V  D8F  [F]
IC501  TMC4361-LI  [QFN40L]
IC502  TMC2660-PA  [PQFP44_WITH_PADS]
J501  22-05-7058-05  [7395-05]
J502  22-05-7048-04  [7395-04]
R501  4k7, 1%  R-EU_R0603  [R0603]
R502  4k7, 1%  R-EU_R0603  [R0603]
R503  4k7, 1%  R-EU_R0603  [R0603]
R504  10R  R-EU_R0603  [R0603]
R505  10R  R-EU_R0603  [R0603]
R506  0R10/0.5W  R-EU_R1206  [R1206]
R507  0R10/0.5W  R-EU_R1206  [R1206]
U$501  SN74LVC3G17-SM8  [SN74LVC3G17-SM8]

### Nets
+3V3: C501.1 C502.2 C505.1 C509.1 IC501.5(VDD5) IC501.19(FREEZE) IC501.26(VDD5) IC501.37(VDD5) IC502.40(VCC_IO) U$501.P$8(VCC) ; also sheet 1,2,3,4,6,7,8,9
+5V: J501.1 R501.2 R502.2 R503.2 ; also sheet 1,2,6,7
+24V: C506.1 C507.1 C508.1 C510.1 C512.2 IC502.4(VSA) IC502.30(VSB) IC502.36(VS) ; also sheet 2,4,6,7,8
A_74LVC_1: IC501.40(A_SCLK) U$501.P$7(1Y)
A_4361_1: J501.2 R501.1 U$501.P$1(1A)
B_74LVC_1: IC501.10(B_SDI) U$501.P$5(2Y)
B_4361_1: J501.3 R502.1 U$501.P$3(2A)
CLK_EXT_2: IC501.38(CLK) IC502.21(CLK) ; also sheet 3
CS_4361_1: IC501.2(NSCSIN) ; also sheet 8
GND: C501.2 C502.1 C503.1 C504.2 C505.2 C507.2 C508.2 C509.2 C510.2 C511.2 C512.1 IC501.6(GND) IC501.13(HOME_REF) IC501.15(GND) IC501.17(STPIN) IC501.18(DIRIN) IC501.22(NNEG) IC501.25(GND) IC501.34(TEST_MODE) IC501.36(GND) IC501.EXP(GND) IC502.17(GND) IC502.19(!EN) IC502.39(GND) IC502.43(TST_MODE) IC502.44(GND) J501.5 R506.2 R507.2 U$501.P$4(GND) ; also sheet 1,2,3,4,6,7,8,9,10
IC502_OA1: IC502.2(OA1) IC502.7(OA1) J502.1
IC502_OA2: IC502.5(OA2) IC502.10(OA2) J502.2
IC502_OB1: IC502.26(OB1) IC502.31(OB1) J502.4
IC502_OB2: IC502.23(OB2) IC502.28(OB2) J502.3
INT_4361_1: IC501.33(INTR) ; also sheet 3
MISO_32U4: IC501.7(SDOIN) ; also sheet 1,3,4,6,7
MOSI_32U4: IC501.4(SDIIN) ; also sheet 1,3,4,6,7
N$34: IC501.28(SDIDRV_NSCLK) IC502.14(SDO)
N$35: IC501.27(SDODRV_SCLK) IC502.15(SDI)
N$37: IC501.29(SCKDRV_NSDO) IC502.16(SCK)
N$38: IC501.30(NSCSDRV_SDO) IC502.18(!CS)
N$39: C511.1 IC502.13(5VOUT)
N$40: C506.2 IC502.35(VHS)
N$42: IC502.22(SRB) R505.1
N$43: IC502.25(BRB) R505.2 R507.1
N$44: IC502.12(SRA) R504.1
N$45: IC502.9(BRA) R504.2 R506.1
N$60: IC501.24(STPOUT_PWMA) IC502.42(STEP)
N$61: IC501.23(DIROUT_PWMB) IC502.41(DIR)
N$111: C503.2 IC501.35(VDD18)
N$112: C504.1 IC501.16(VDD18)
N_74LVC_1: IC501.21(N) U$501.P$2(3Y)
N_4361_1: J501.4 R503.1 U$501.P$6(3A)
RST_MOTION_CONTROLLER: IC501.39(NRST) ; also sheet 3,6,7
SCK_32U4: IC501.3(SCKIN) ; also sheet 1,3,4,6,7
SG_2660_1: IC501.8(DCSTEP_STALL) IC502.38(SG_TST)
START: IC501.20(START) ; also sheet 1,3,6,7
STOP_1_L: IC501.12(STOPL) ; also sheet 9
STOP_1_R: IC501.14(STOPR) ; also sheet 9
TR_4361_1: IC501.31(TR) ; also sheet 1
Unconnected: IC501.1(ANEG_NSCLK) IC501.9(DC_OUT) IC501.11(BNEG_NSDI) IC501.32(STDBY_CLK) IC502.37(TST_ANA)

### Notes on the sheet
- SN74LVC3G17DCTR

## Sheet 6 of 10
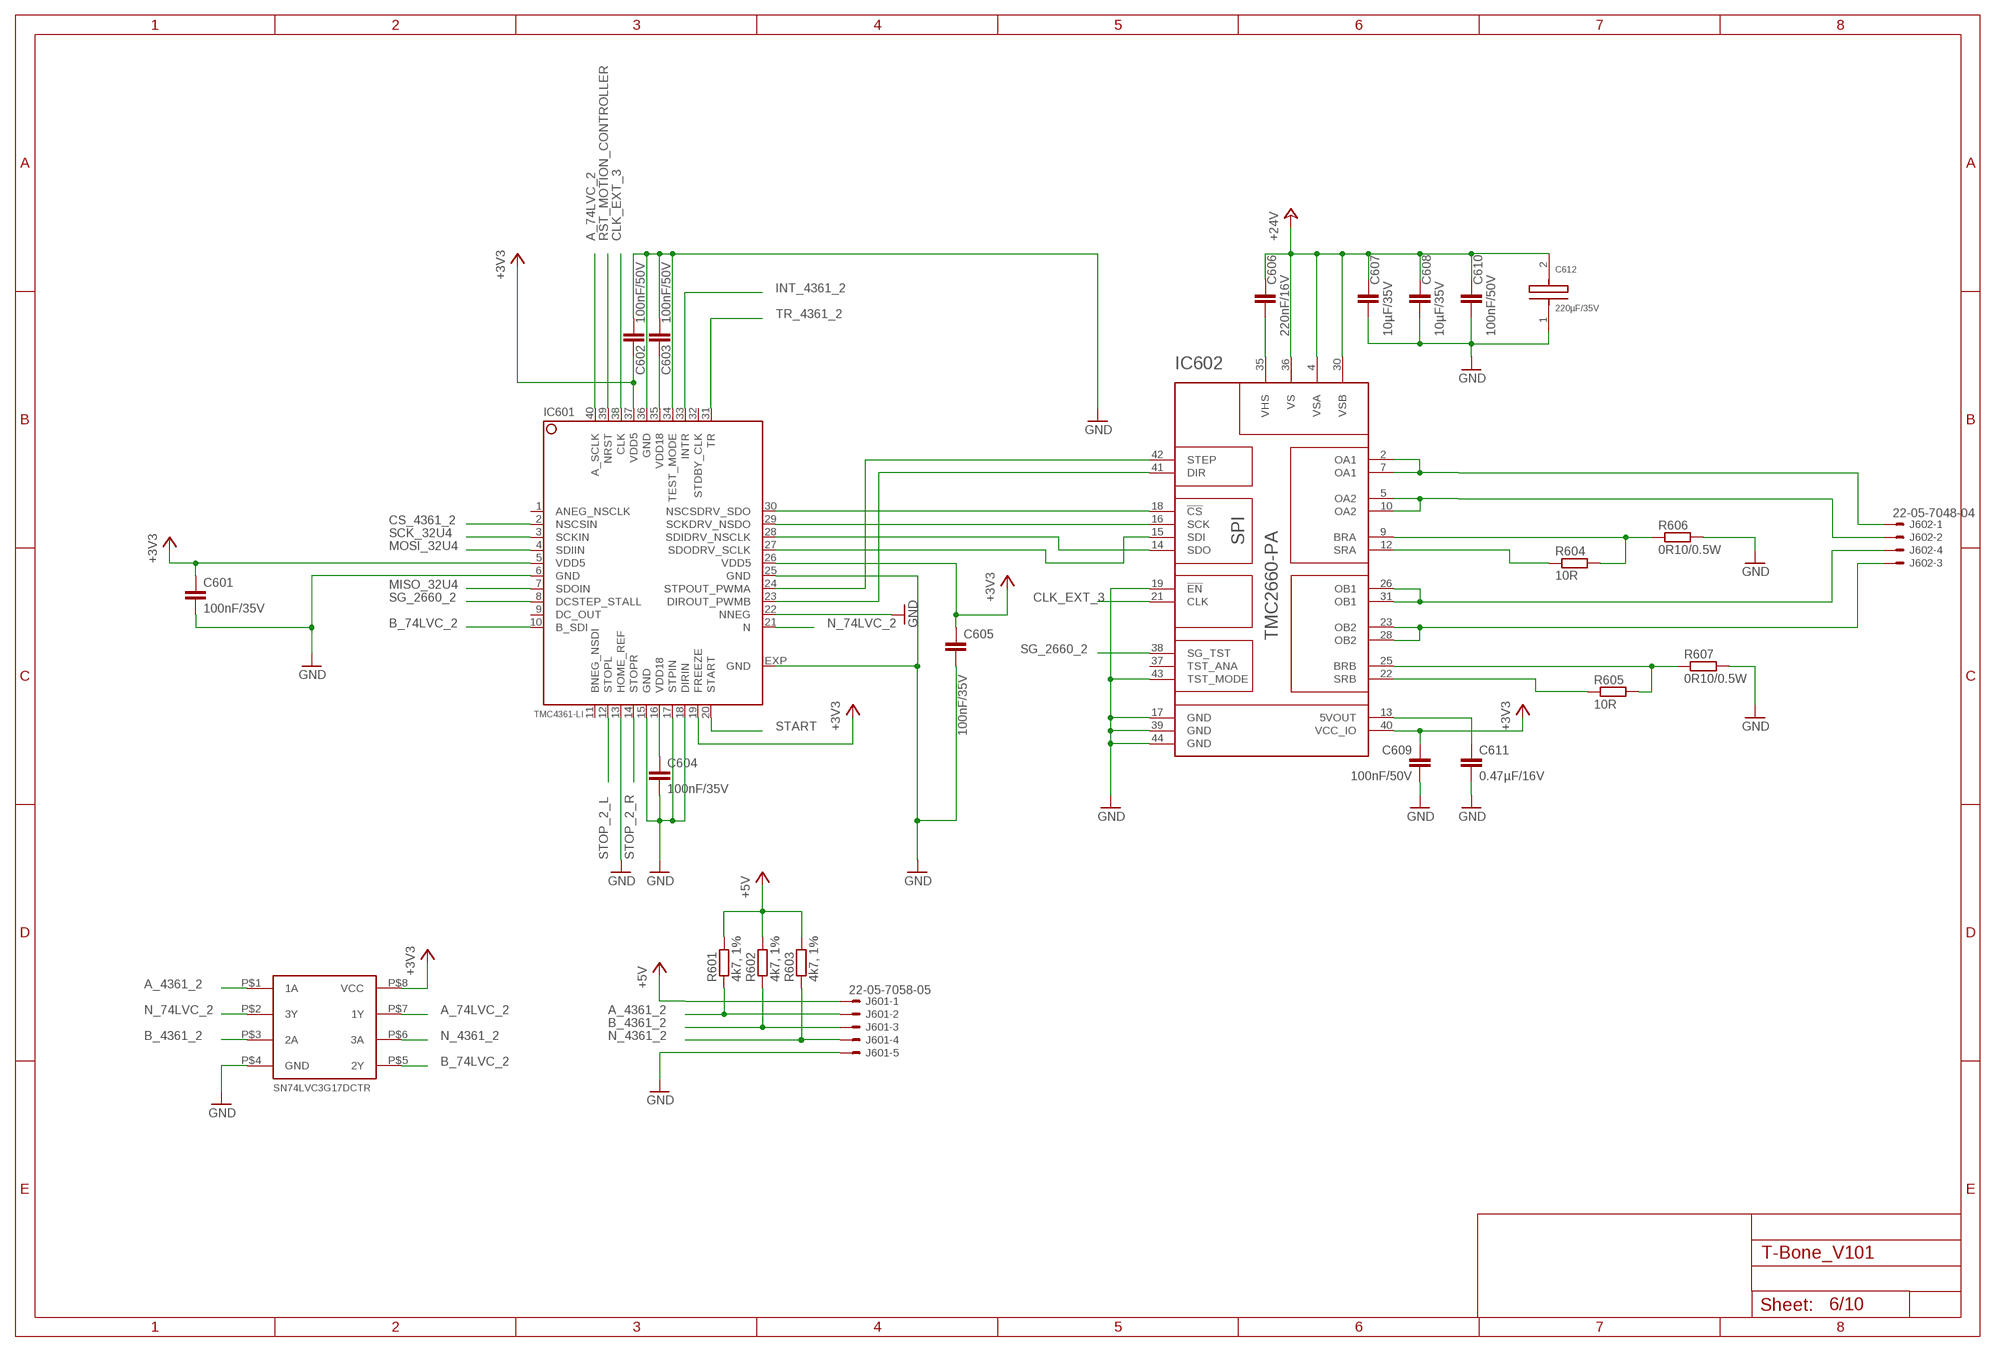
[diagram p5: schematic, sheet 6]

### Parts
C601  100nF/35V  C-EUC0603K  [C0603K]
C602  100nF/50V  C-EUC0603K  [C0603K]
C603  100nF/50V  C-EUC0603K  [C0603K]
C604  100nF/35V  C-EUC0603K  [C0603K]
C605  100nF/35V  C-EUC0603K  [C0603K]
C606  220nF/16V  C-EUC0603K  [C0603K]
C607  10µF/35V  C-EUC1210K  [C1210K]
C608  10µF/35V  C-EUC1210K  [C1210K]
C609  100nF/50V  C-EUC0603K  [C0603K]
C610  100nF/50V  C-EUC0603K  [C0603K]
C611  0.47µF/16V  C-EUC0603K  [C0603K]
C612  220µF/35V  D8F  [F]
IC601  TMC4361-LI  [QFN40L]
IC602  TMC2660-PA  [PQFP44_WITH_PADS]
J601  22-05-7058-05  [7395-05]
J602  22-05-7048-04  [7395-04]
R601  4k7, 1%  R-EU_R0603  [R0603]
R602  4k7, 1%  R-EU_R0603  [R0603]
R603  4k7, 1%  R-EU_R0603  [R0603]
R604  10R  R-EU_R0603  [R0603]
R605  10R  R-EU_R0603  [R0603]
R606  0R10/0.5W  R-EU_R1206  [R1206]
R607  0R10/0.5W  R-EU_R1206  [R1206]
U$601  SN74LVC3G17-SM8  [SN74LVC3G17-SM8]

### Nets
+3V3: C601.1 C602.2 C605.1 C609.1 IC601.5(VDD5) IC601.19(FREEZE) IC601.26(VDD5) IC601.37(VDD5) IC602.40(VCC_IO) U$601.P$8(VCC) ; also sheet 1,2,3,4,5,7,8,9
+5V: J601.1 R601.2 R602.2 R603.2 ; also sheet 1,2,5,7
+24V: C606.1 C607.1 C608.1 C610.1 C612.2 IC602.4(VSA) IC602.30(VSB) IC602.36(VS) ; also sheet 2,4,5,7,8
A_74LVC_2: IC601.40(A_SCLK) U$601.P$7(1Y)
A_4361_2: J601.2 R601.1 U$601.P$1(1A)
B_74LVC_2: IC601.10(B_SDI) U$601.P$5(2Y)
B_4361_2: J601.3 R602.1 U$601.P$3(2A)
CLK_EXT_3: IC601.38(CLK) IC602.21(CLK) ; also sheet 3
CS_4361_2: IC601.2(NSCSIN) ; also sheet 8
GND: C601.2 C602.1 C603.1 C604.2 C605.2 C607.2 C608.2 C609.2 C610.2 C611.2 C612.1 IC601.6(GND) IC601.13(HOME_REF) IC601.15(GND) IC601.17(STPIN) IC601.18(DIRIN) IC601.22(NNEG) IC601.25(GND) IC601.34(TEST_MODE) IC601.36(GND) IC601.EXP(GND) IC602.17(GND) IC602.19(!EN) IC602.39(GND) IC602.43(TST_MODE) IC602.44(GND) J601.5 R606.2 R607.2 U$601.P$4(GND) ; also sheet 1,2,3,4,5,7,8,9,10
IC602_OA1: IC602.2(OA1) IC602.7(OA1) J602.1
IC602_OA2: IC602.5(OA2) IC602.10(OA2) J602.2
IC602_OB1: IC602.26(OB1) IC602.31(OB1) J602.4
IC602_OB2: IC602.23(OB2) IC602.28(OB2) J602.3
INT_4361_2: IC601.33(INTR) ; also sheet 3
MISO_32U4: IC601.7(SDOIN) ; also sheet 1,3,4,5,7
MOSI_32U4: IC601.4(SDIIN) ; also sheet 1,3,4,5,7
N$20: IC601.28(SDIDRV_NSCLK) IC602.14(SDO)
N$21: IC601.27(SDODRV_SCLK) IC602.15(SDI)
N$26: IC601.29(SCKDRV_NSDO) IC602.16(SCK)
N$50: IC602.9(BRA) R604.2 R606.1
N$51: IC602.12(SRA) R604.1
N$54: IC601.30(NSCSDRV_SDO) IC602.18(!CS)
N$55: C606.2 IC602.35(VHS)
N$58: IC601.24(STPOUT_PWMA) IC602.42(STEP)
N$59: IC601.23(DIROUT_PWMB) IC602.41(DIR)
N$62: C611.1 IC602.13(5VOUT)
N$66: IC602.25(BRB) R605.2 R607.1
N$68: IC602.22(SRB) R605.1
N$78: C603.2 IC601.35(VDD18)
N$79: C604.1 IC601.16(VDD18)
N_74LVC_2: IC601.21(N) U$601.P$2(3Y)
N_4361_2: J601.4 R603.1 U$601.P$6(3A)
RST_MOTION_CONTROLLER: IC601.39(NRST) ; also sheet 3,5,7
SCK_32U4: IC601.3(SCKIN) ; also sheet 1,3,4,5,7
SG_2660_2: IC601.8(DCSTEP_STALL) IC602.38(SG_TST)
START: IC601.20(START) ; also sheet 1,3,5,7
STOP_2_L: IC601.12(STOPL) ; also sheet 9
STOP_2_R: IC601.14(STOPR) ; also sheet 9
TR_4361_2: IC601.31(TR) ; also sheet 1
Unconnected: IC601.1(ANEG_NSCLK) IC601.9(DC_OUT) IC601.11(BNEG_NSDI) IC601.32(STDBY_CLK) IC602.37(TST_ANA)

### Notes on the sheet
- SN74LVC3G17DCTR

## Sheet 7 of 10
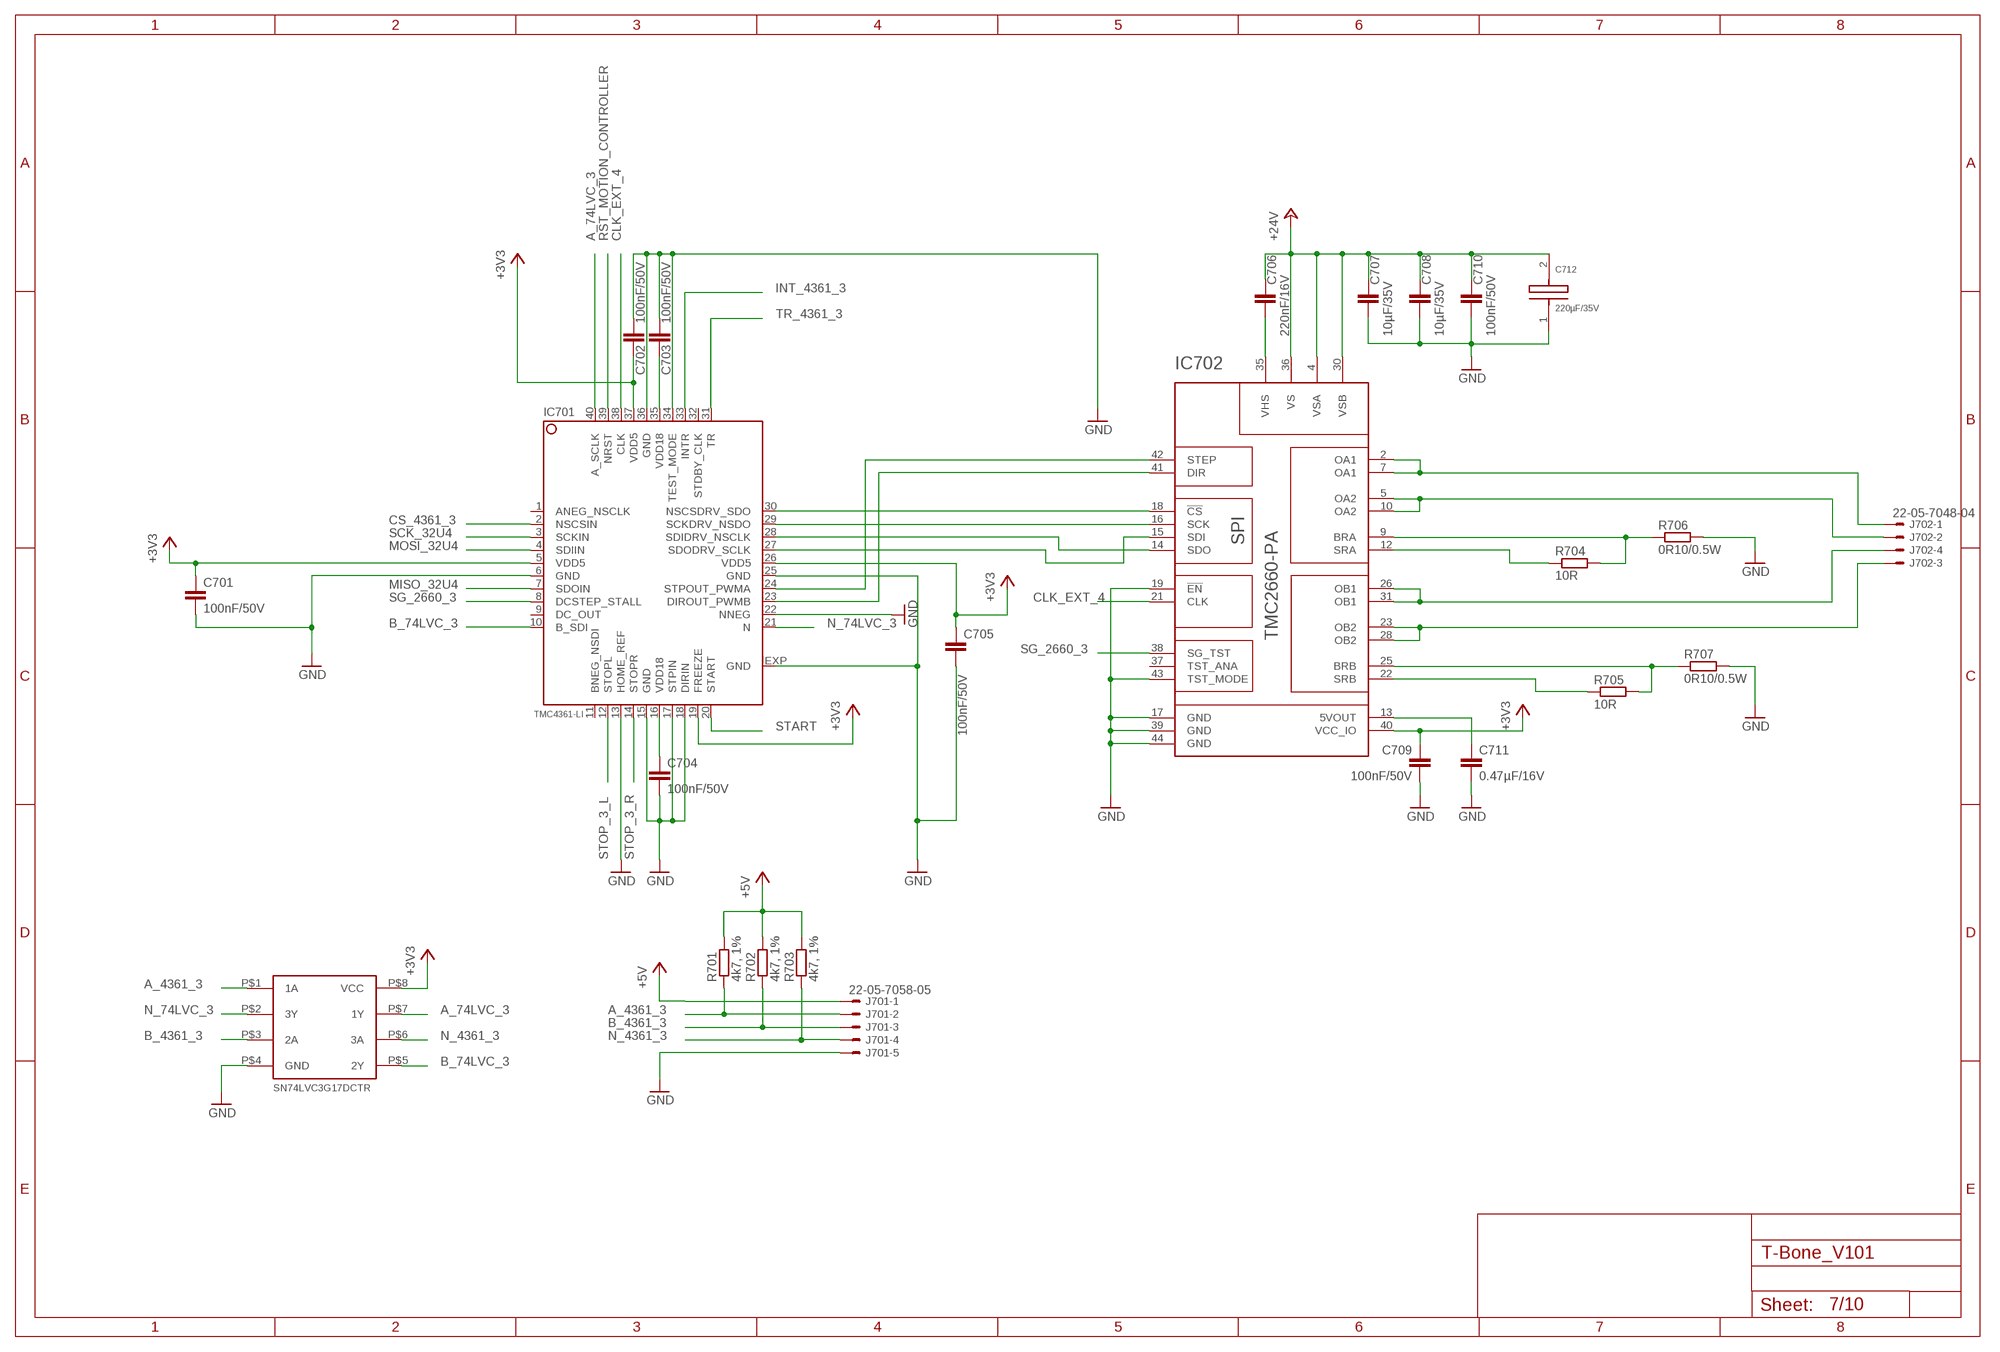
[diagram p6: schematic, sheet 7]

### Parts
C701  100nF/50V  C-EUC0603K  [C0603K]
C702  100nF/50V  C-EUC0603K  [C0603K]
C703  100nF/50V  C-EUC0603K  [C0603K]
C704  100nF/50V  C-EUC0603K  [C0603K]
C705  100nF/50V  C-EUC0603K  [C0603K]
C706  220nF/16V  C-EUC0603K  [C0603K]
C707  10µF/35V  C-EUC1210K  [C1210K]
C708  10µF/35V  C-EUC1210K  [C1210K]
C709  100nF/50V  C-EUC0603K  [C0603K]
C710  100nF/50V  C-EUC0603K  [C0603K]
C711  0.47µF/16V  C-EUC0603K  [C0603K]
C712  220µF/35V  D8F  [F]
IC701  TMC4361-LI  [QFN40L]
IC702  TMC2660-PA  [PQFP44_WITH_PADS]
J701  22-05-7058-05  [7395-05]
J702  22-05-7048-04  [7395-04]
R701  4k7, 1%  R-EU_R0603  [R0603]
R702  4k7, 1%  R-EU_R0603  [R0603]
R703  4k7, 1%  R-EU_R0603  [R0603]
R704  10R  R-EU_R0603  [R0603]
R705  10R  R-EU_R0603  [R0603]
R706  0R10/0.5W  R-EU_R1206  [R1206]
R707  0R10/0.5W  R-EU_R1206  [R1206]
U$701  SN74LVC3G17-SM8  [SN74LVC3G17-SM8]

### Nets
+3V3: C701.1 C702.2 C705.1 C709.1 IC701.5(VDD5) IC701.19(FREEZE) IC701.26(VDD5) IC701.37(VDD5) IC702.40(VCC_IO) U$701.P$8(VCC) ; also sheet 1,2,3,4,5,6,8,9
+5V: J701.1 R701.2 R702.2 R703.2 ; also sheet 1,2,5,6
+24V: C706.1 C707.1 C708.1 C710.1 C712.2 IC702.4(VSA) IC702.30(VSB) IC702.36(VS) ; also sheet 2,4,5,6,8
A_74LVC_3: IC701.40(A_SCLK) U$701.P$7(1Y)
A_4361_3: J701.2 R701.1 U$701.P$1(1A)
B_74LVC_3: IC701.10(B_SDI) U$701.P$5(2Y)
B_4361_3: J701.3 R702.1 U$701.P$3(2A)
CLK_EXT_4: IC701.38(CLK) IC702.21(CLK) ; also sheet 3
CS_4361_3: IC701.2(NSCSIN) ; also sheet 8
GND: C701.2 C702.1 C703.1 C704.2 C705.2 C707.2 C708.2 C709.2 C710.2 C711.2 C712.1 IC701.6(GND) IC701.13(HOME_REF) IC701.15(GND) IC701.17(STPIN) IC701.18(DIRIN) IC701.22(NNEG) IC701.25(GND) IC701.34(TEST_MODE) IC701.36(GND) IC701.EXP(GND) IC702.17(GND) IC702.19(!EN) IC702.39(GND) IC702.43(TST_MODE) IC702.44(GND) J701.5 R706.2 R707.2 U$701.P$4(GND) ; also sheet 1,2,3,4,5,6,8,9,10
IC702_OA1: IC702.2(OA1) IC702.7(OA1) J702.1
IC702_OA2: IC702.5(OA2) IC702.10(OA2) J702.2
IC702_OB1: IC702.26(OB1) IC702.31(OB1) J702.4
IC702_OB2: IC702.23(OB2) IC702.28(OB2) J702.3
INT_4361_3: IC701.33(INTR) ; also sheet 3
MISO_32U4: IC701.7(SDOIN) ; also sheet 1,3,4,5,6
MOSI_32U4: IC701.4(SDIIN) ; also sheet 1,3,4,5,6
N$19: IC701.24(STPOUT_PWMA) IC702.42(STEP)
N$32: IC701.23(DIROUT_PWMB) IC702.41(DIR)
N$36: IC701.28(SDIDRV_NSCLK) IC702.14(SDO)
N$46: IC701.27(SDODRV_SCLK) IC702.15(SDI)
N$63: C711.1 IC702.13(5VOUT)
N$70: IC702.9(BRA) R704.2 R706.1
N$71: IC702.12(SRA) R704.1
N$82: IC701.29(SCKDRV_NSDO) IC702.16(SCK)
N$83: IC701.30(NSCSDRV_SDO) IC702.18(!CS)
N$84: C706.2 IC702.35(VHS)
N$87: IC702.25(BRB) R705.2 R707.1
N$89: IC702.22(SRB) R705.1
N$99: C703.2 IC701.35(VDD18)
N$100: C704.1 IC701.16(VDD18)
N_74LVC_3: IC701.21(N) U$701.P$2(3Y)
N_4361_3: J701.4 R703.1 U$701.P$6(3A)
RST_MOTION_CONTROLLER: IC701.39(NRST) ; also sheet 3,5,6
SCK_32U4: IC701.3(SCKIN) ; also sheet 1,3,4,5,6
SG_2660_3: IC701.8(DCSTEP_STALL) IC702.38(SG_TST)
START: IC701.20(START) ; also sheet 1,3,5,6
STOP_3_L: IC701.12(STOPL) ; also sheet 9
STOP_3_R: IC701.14(STOPR) ; also sheet 9
TR_4361_3: IC701.31(TR) ; also sheet 1
Unconnected: IC701.1(ANEG_NSCLK) IC701.9(DC_OUT) IC701.11(BNEG_NSDI) IC701.32(STDBY_CLK) IC702.37(TST_ANA)

### Notes on the sheet
- SN74LVC3G17DCTR

## Sheet 8 of 10
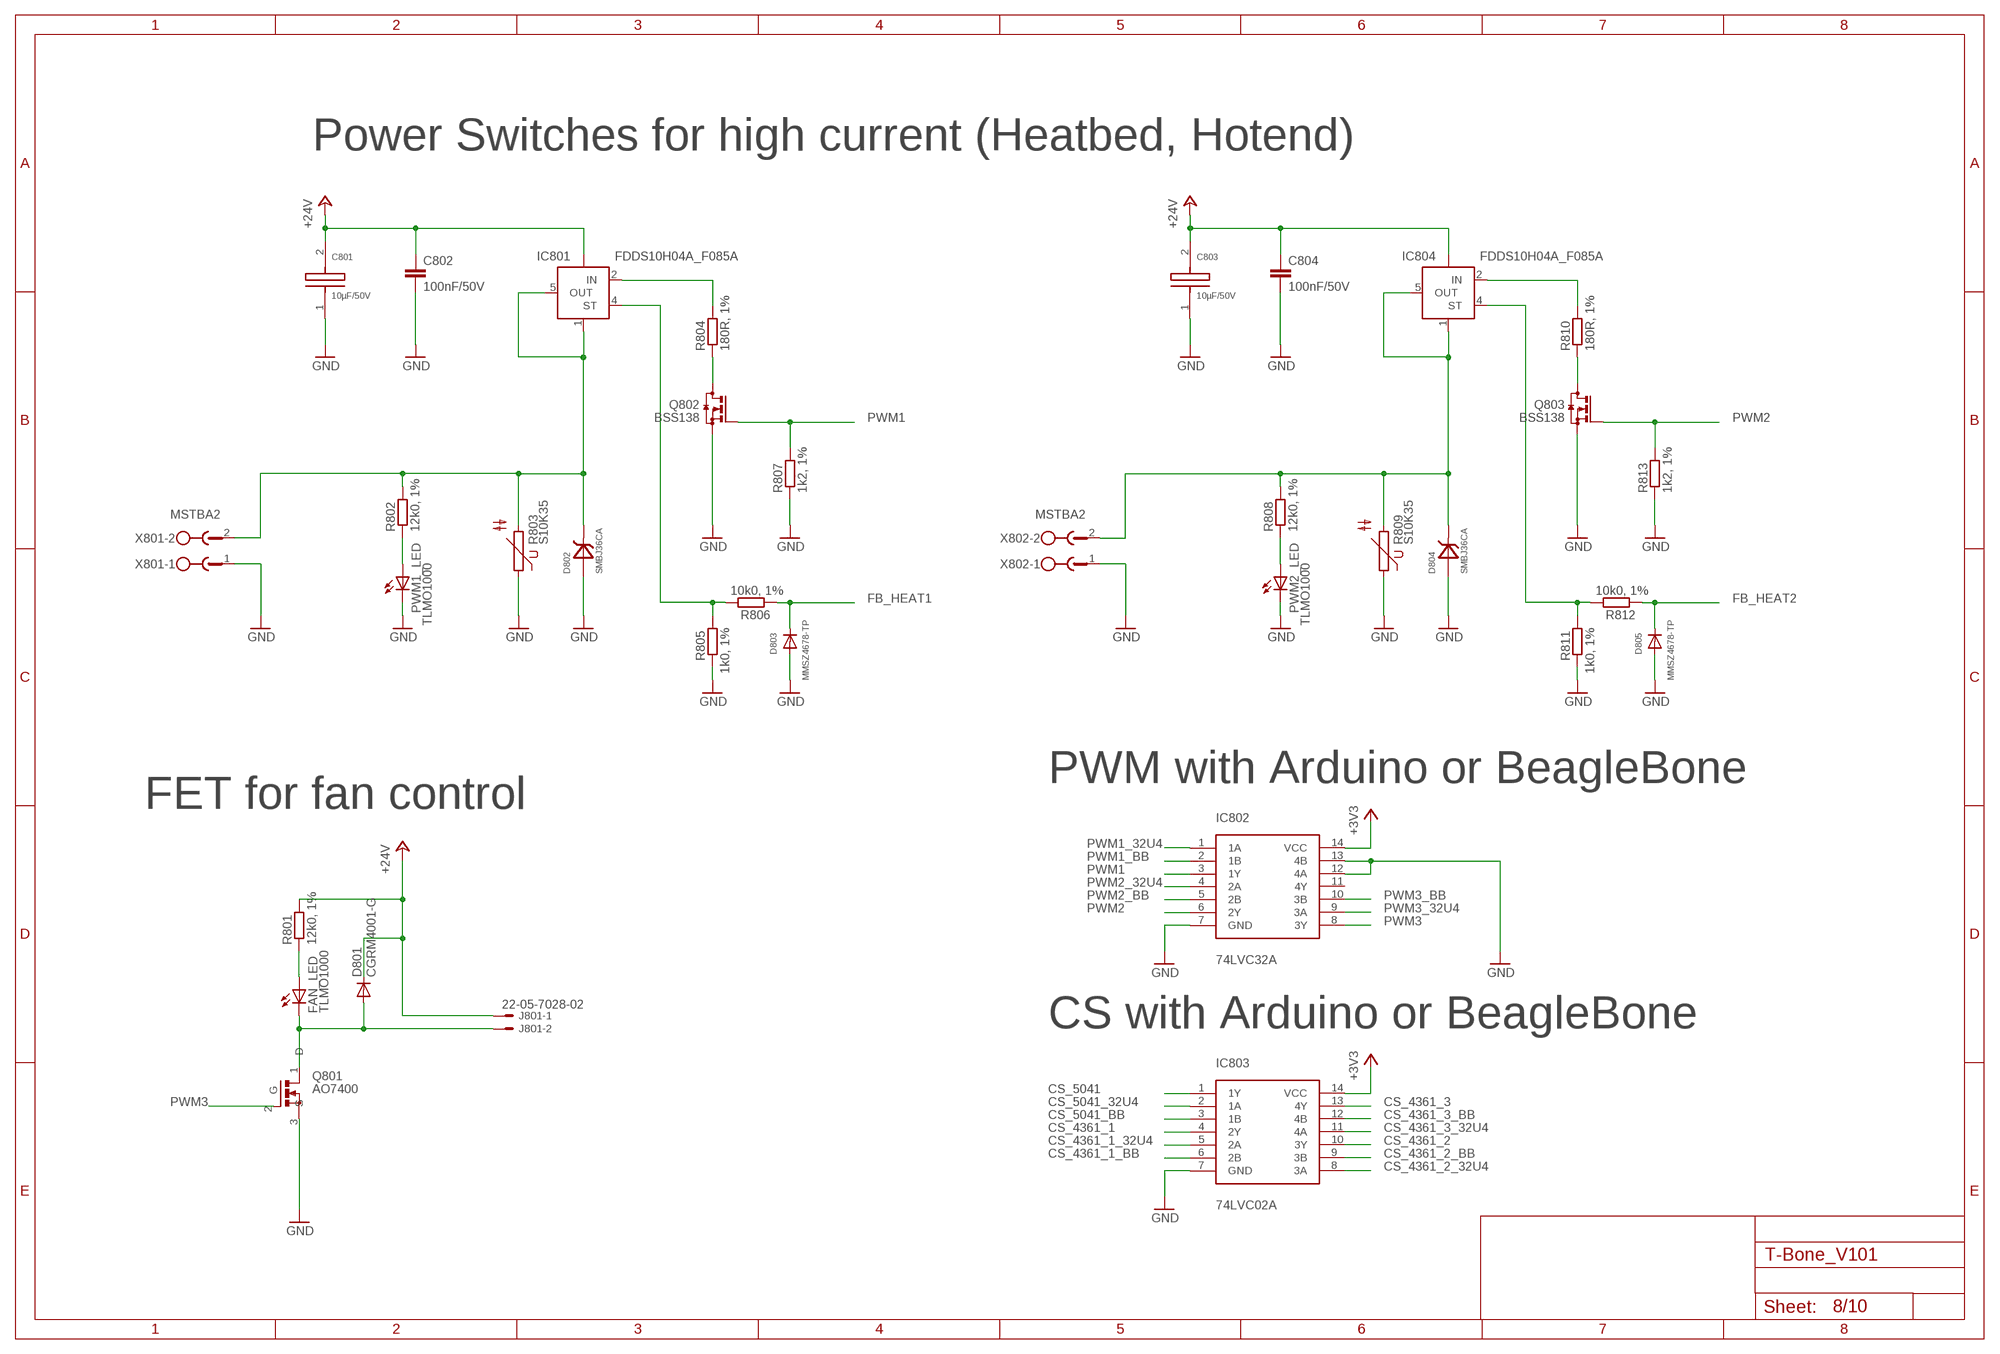
[diagram p7: schematic, sheet 8]

### Parts
C801  10µF/50V  D8  [D8]
C802  100nF/50V  C-EUC0805K  [C0805K]
C803  10µF/50V  D8  [D8]
C804  100nF/50V  C-EUC0805K  [C0805K]
D801  CGRM4001-G  [SOD-123_MINI-SMA]
D802  SMBJ36CA  SMBJ48A  [SMB]
D803  MMSZ4678-TP  DIODESOD-123  [SOD-123]
D804  SMBJ36CA  SMBJ48A  [SMB]
D805  MMSZ4678-TP  DIODESOD-123  [SOD-123]
FAN_LED  TLMO1000  LEDCHIP-LED0603  [CHIP-LED0603]
IC801  FDDS10H04A_F085A  BTS428L2  [TO252-5-11]
IC802  74LVC32A  [14-VFQFN]
IC803  74LVC02A  [14-VFQFN]
IC804  FDDS10H04A_F085A  BTS428L2  [TO252-5-11]
J801  22-05-7028-02  [7395-02]
PWM1_LED  TLMO1000  LEDCHIP-LED0603  [CHIP-LED0603]
PWM2_LED  TLMO1000  LEDCHIP-LED0603  [CHIP-LED0603]
Q801  AO7400  [SOT323]
Q802  BSS138  BSS123  [SOT23]
Q803  BSS138  BSS123  [SOT23]
R801  12k0, 1%  R-EU_R0603  [R0603]
R802  12k0, 1%  R-EU_R0603  [R0603]
R803  S10K35  S10K40  [S10K40]
R804  180R, 1%  R-EU_R0603  [R0603]
R805  1k0, 1%  R-EU_R0603  [R0603]
R806  10k0, 1%  R-EU_R0603  [R0603]
R807  1k2, 1%  R-EU_R0603  [R0603]
R808  12k0, 1%  R-EU_R0603  [R0603]
R809  S10K35  S10K40  [S10K40]
R810  180R, 1%  R-EU_R0603  [R0603]
R811  1k0, 1%  R-EU_R0603  [R0603]
R812  10k0, 1%  R-EU_R0603  [R0603]
R813  1k2, 1%  R-EU_R0603  [R0603]
X801  MSTBA2  [MSTBA2]
X802  MSTBA2  [MSTBA2]

### Nets
+3V3: IC802.14(VCC) IC803.14(VCC) ; also sheet 1,2,3,4,5,6,7,9
+24V: C801.2 C802.1 C803.2 C804.1 D801.C IC801.TAB(VBB) IC804.TAB(VBB) J801.1 R801.2 ; also sheet 2,4,5,6,7
CS_4361_1: IC803.4(2Y) ; also sheet 5
CS_4361_1_32U4: IC803.5(2A) ; also sheet 3
CS_4361_1_BB: IC803.6(2B) ; also sheet 1
CS_4361_2: IC803.10(3Y) ; also sheet 6
CS_4361_2_32U4: IC803.8(3A) ; also sheet 3
CS_4361_2_BB: IC803.9(3B) ; also sheet 1
CS_4361_3: IC803.13(4Y) ; also sheet 7
CS_4361_3_32U4: IC803.11(4A) ; also sheet 3
CS_4361_3_BB: IC803.12(4B) ; also sheet 1
CS_5041: IC803.1(1Y) ; also sheet 4
CS_5041_32U4: IC803.2(1A) ; also sheet 3
CS_5041_BB: IC803.3(1B) ; also sheet 1
FB_HEAT1: D803.C R806.1 ; also sheet 1,3
FB_HEAT2: D805.C R812.1 ; also sheet 1,3
GND: C801.1 C802.2 C803.1 C804.2 D802.A D803.A D804.A D805.A IC802.7(GND) IC802.12(4A) IC802.13(4B) IC803.7(GND) PWM1_LED.C PWM2_LED.C Q801.3(S) Q802.2(S) Q803.2(S) R803.1 R805.1 R807.1 R809.1 R811.1 R813.1 X801.1 X802.1 ; also sheet 1,2,3,4,5,6,7,9,10
HEAT1: D802.C IC801.1(GND) IC801.5(OUT) R802.2 R803.2 X801.2
HEAT2: D804.C IC804.1(GND) IC804.5(OUT) R808.2 R809.2 X802.2
N$41: Q802.3(D) R804.1
N$56: D801.A FAN_LED.C J801.2 Q801.1(D)
N$65: FAN_LED.A R801.1
N$93: PWM1_LED.A R802.1
N$94: PWM2_LED.A R808.1
N$114: IC801.4(ST) R805.2 R806.2
N$115: IC801.2(IN) R804.2
N$116: Q803.3(D) R810.1
N$117: IC804.4(ST) R811.2 R812.2
N$118: IC804.2(IN) R810.2
PWM1: IC802.3(1Y) Q802.1(G) R807.2
PWM1_32U4: IC802.1(1A) ; also sheet 3
PWM1_BB: IC802.2(1B) ; also sheet 1
PWM2: IC802.6(2Y) Q803.1(G) R813.2
PWM2_32U4: IC802.4(2A) ; also sheet 3
PWM2_BB: IC802.5(2B) ; also sheet 1
PWM3: IC802.8(3Y) Q801.2(G)
PWM3_32U4: IC802.9(3A) ; also sheet 3
PWM3_BB: IC802.10(3B) ; also sheet 1
Unconnected: IC802.11(4Y)

### Notes on the sheet
- Power Switches for high current (Heatbed, Hotend)
- PWM with Arduino or BeagleBone
- FET for fan control
- CS with Arduino or BeagleBone

## Sheet 9 of 10
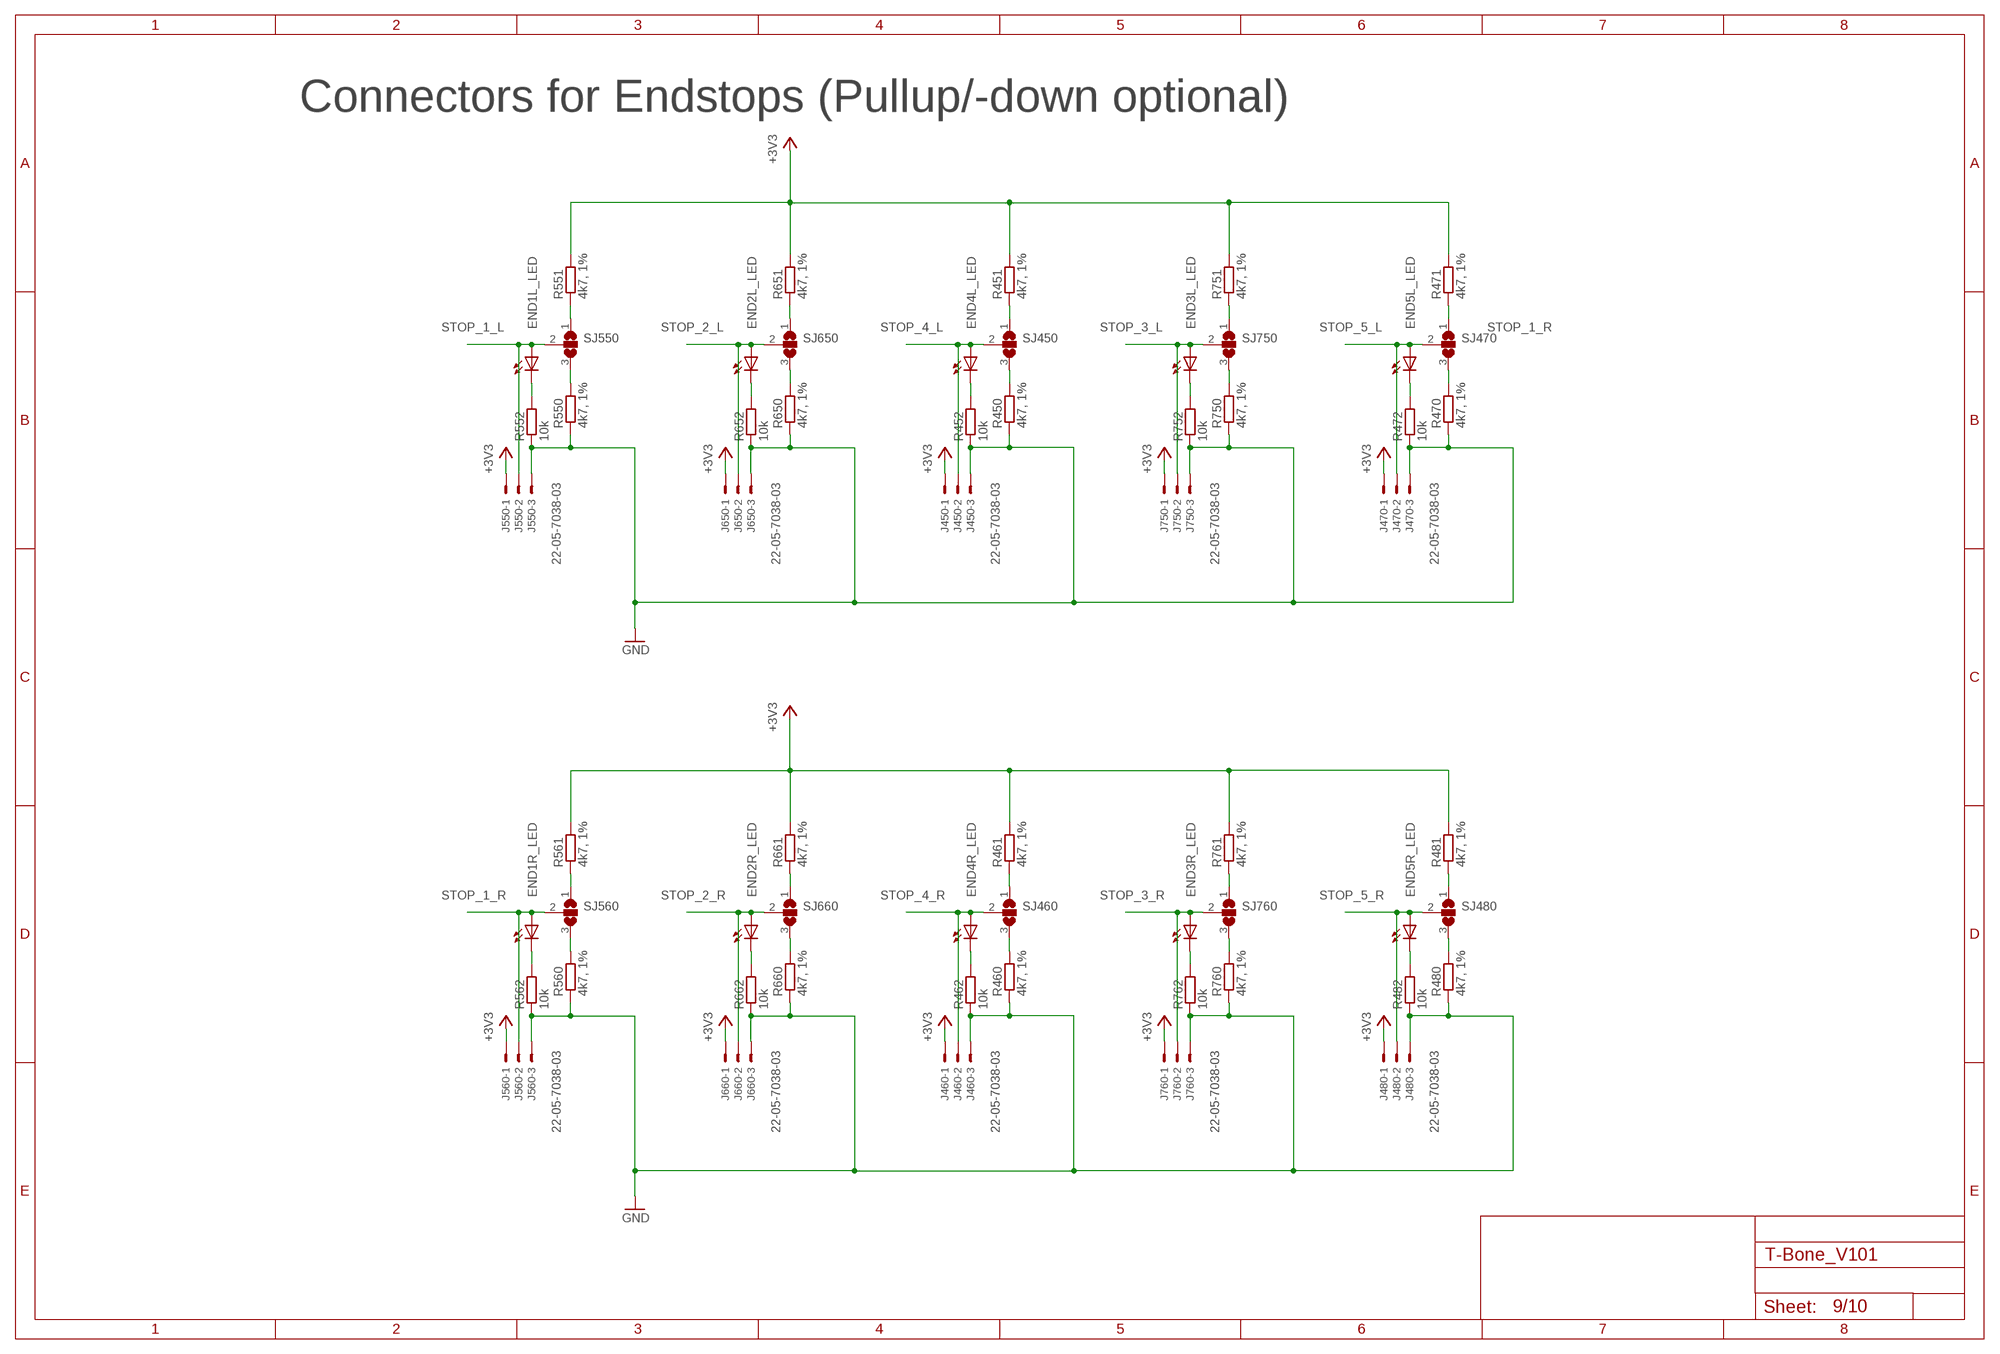
[diagram p8: schematic, sheet 9]

### Parts
END1L_LED  LEDCHIP-LED0603  [CHIP-LED0603]
END1R_LED  LEDCHIP-LED0603  [CHIP-LED0603]
END2L_LED  LEDCHIP-LED0603  [CHIP-LED0603]
END2R_LED  LEDCHIP-LED0603  [CHIP-LED0603]
END3L_LED  LEDCHIP-LED0603  [CHIP-LED0603]
END3R_LED  LEDCHIP-LED0603  [CHIP-LED0603]
END4L_LED  LEDCHIP-LED0603  [CHIP-LED0603]
END4R_LED  LEDCHIP-LED0603  [CHIP-LED0603]
END5L_LED  LEDCHIP-LED0603  [CHIP-LED0603]
END5R_LED  LEDCHIP-LED0603  [CHIP-LED0603]
J450  22-05-7038-03  [7395-03]
J460  22-05-7038-03  [7395-03]
J470  22-05-7038-03  [7395-03]
J480  22-05-7038-03  [7395-03]
J550  22-05-7038-03  [7395-03]
J560  22-05-7038-03  [7395-03]
J650  22-05-7038-03  [7395-03]
J660  22-05-7038-03  [7395-03]
J750  22-05-7038-03  [7395-03]
J760  22-05-7038-03  [7395-03]
R450  4k7, 1%  R-EU_R0402  [R0402]
R451  4k7, 1%  R-EU_R0402  [R0402]
R452  10k  R-EU_R0402  [R0402]
R460  4k7, 1%  R-EU_R0402  [R0402]
R461  4k7, 1%  R-EU_R0402  [R0402]
R462  10k  R-EU_R0402  [R0402]
R470  4k7, 1%  R-EU_R0402  [R0402]
R471  4k7, 1%  R-EU_R0402  [R0402]
R472  10k  R-EU_R0402  [R0402]
R480  4k7, 1%  R-EU_R0402  [R0402]
R481  4k7, 1%  R-EU_R0402  [R0402]
R482  10k  R-EU_R0402  [R0402]
R550  4k7, 1%  R-EU_R0402  [R0402]
R551  4k7, 1%  R-EU_R0402  [R0402]
R552  10k  R-EU_R0402  [R0402]
R560  4k7, 1%  R-EU_R0402  [R0402]
R561  4k7, 1%  R-EU_R0402  [R0402]
R562  10k  R-EU_R0402  [R0402]
R650  4k7, 1%  R-EU_R0402  [R0402]
R651  4k7, 1%  R-EU_R0402  [R0402]
R652  10k  R-EU_R0402  [R0402]
R660  4k7, 1%  R-EU_R0402  [R0402]
R661  4k7, 1%  R-EU_R0402  [R0402]
R662  10k  R-EU_R0402  [R0402]
R750  4k7, 1%  R-EU_R0402  [R0402]
R751  4k7, 1%  R-EU_R0402  [R0402]
R752  10k  R-EU_R0402  [R0402]
R760  4k7, 1%  R-EU_R0402  [R0402]
R761  4k7, 1%  R-EU_R0402  [R0402]
R762  10k  R-EU_R0402  [R0402]
SJ450  SJ2W  [SJ_2]
SJ460  SJ2W  [SJ_2]
SJ470  SJ2W  [SJ_2]
SJ480  SJ2W  [SJ_2]
SJ550  SJ2W  [SJ_2]
SJ560  SJ2W  [SJ_2]
SJ650  SJ2W  [SJ_2]
SJ660  SJ2W  [SJ_2]
SJ750  SJ2W  [SJ_2]
SJ760  SJ2W  [SJ_2]

### Nets
+3V3: J450.1 J460.1 J470.1 J480.1 J550.1 J560.1 J650.1 J660.1 J750.1 J760.1 R451.2 R461.2 R471.2 R481.2 R551.2 R561.2 R651.2 R661.2 R751.2 R761.2 ; also sheet 1,2,3,4,5,6,7,8
GND: J450.3 J460.3 J470.3 J480.3 J550.3 J560.3 J650.3 J660.3 J750.3 J760.3 R450.1 R452.1 R460.1 R462.1 R470.1 R472.1 R480.1 R482.1 R550.1 R552.1 R560.1 R562.1 R650.1 R652.1 R660.1 R662.1 R750.1 R752.1 R760.1 R762.1 ; also sheet 1,2,3,4,5,6,7,8,10
N$31: R471.1 SJ470.1
N$48: END1L_LED.C R552.2
N$49: END2L_LED.C R652.2
N$52: R470.2 SJ470.3
N$53: END4L_LED.C R452.2
N$64: END3L_LED.C R752.2
N$67: END1R_LED.C R562.2
N$69: END2R_LED.C R662.2
N$72: END4R_LED.C R462.2
N$73: END3R_LED.C R762.2
N$74: END5L_LED.C R472.2
N$75: R481.1 SJ480.1
N$80: R480.2 SJ480.3
N$81: END5R_LED.C R482.2
N$96: R650.2 SJ650.3
N$97: R651.1 SJ650.1
N$98: R451.1 SJ450.1
N$101: R550.2 SJ550.3
N$102: R551.1 SJ550.1
N$106: R450.2 SJ450.3
N$110: R560.2 SJ560.3
N$113: R561.1 SJ560.1
N$119: R661.1 SJ660.1
N$120: R660.2 SJ660.3
N$121: R460.2 SJ460.3
N$122: R461.1 SJ460.1
N$127: R751.1 SJ750.1
N$128: R750.2 SJ750.3
N$130: R761.1 SJ760.1
N$131: R760.2 SJ760.3
STOP_1_L: END1L_LED.A J550.2 SJ550.2 ; also sheet 5
STOP_1_R: END1R_LED.A J560.2 SJ560.2 ; also sheet 5
STOP_2_L: END2L_LED.A J650.2 SJ650.2 ; also sheet 6
STOP_2_R: END2R_LED.A J660.2 SJ660.2 ; also sheet 6
STOP_3_L: END3L_LED.A J750.2 SJ750.2 ; also sheet 7
STOP_3_R: END3R_LED.A J760.2 SJ760.2 ; also sheet 7
STOP_4_L: END4L_LED.A J450.2 SJ450.2 ; also sheet 4
STOP_4_R: END4R_LED.A J460.2 SJ460.2 ; also sheet 4
STOP_5_L: END5L_LED.A J470.2 SJ470.2 ; also sheet 4
STOP_5_R: END5R_LED.A J480.2 SJ480.2 ; also sheet 4

### Notes on the sheet
- Connectors for Endstops (Pullup/-down optional)

## Sheet 10 of 10
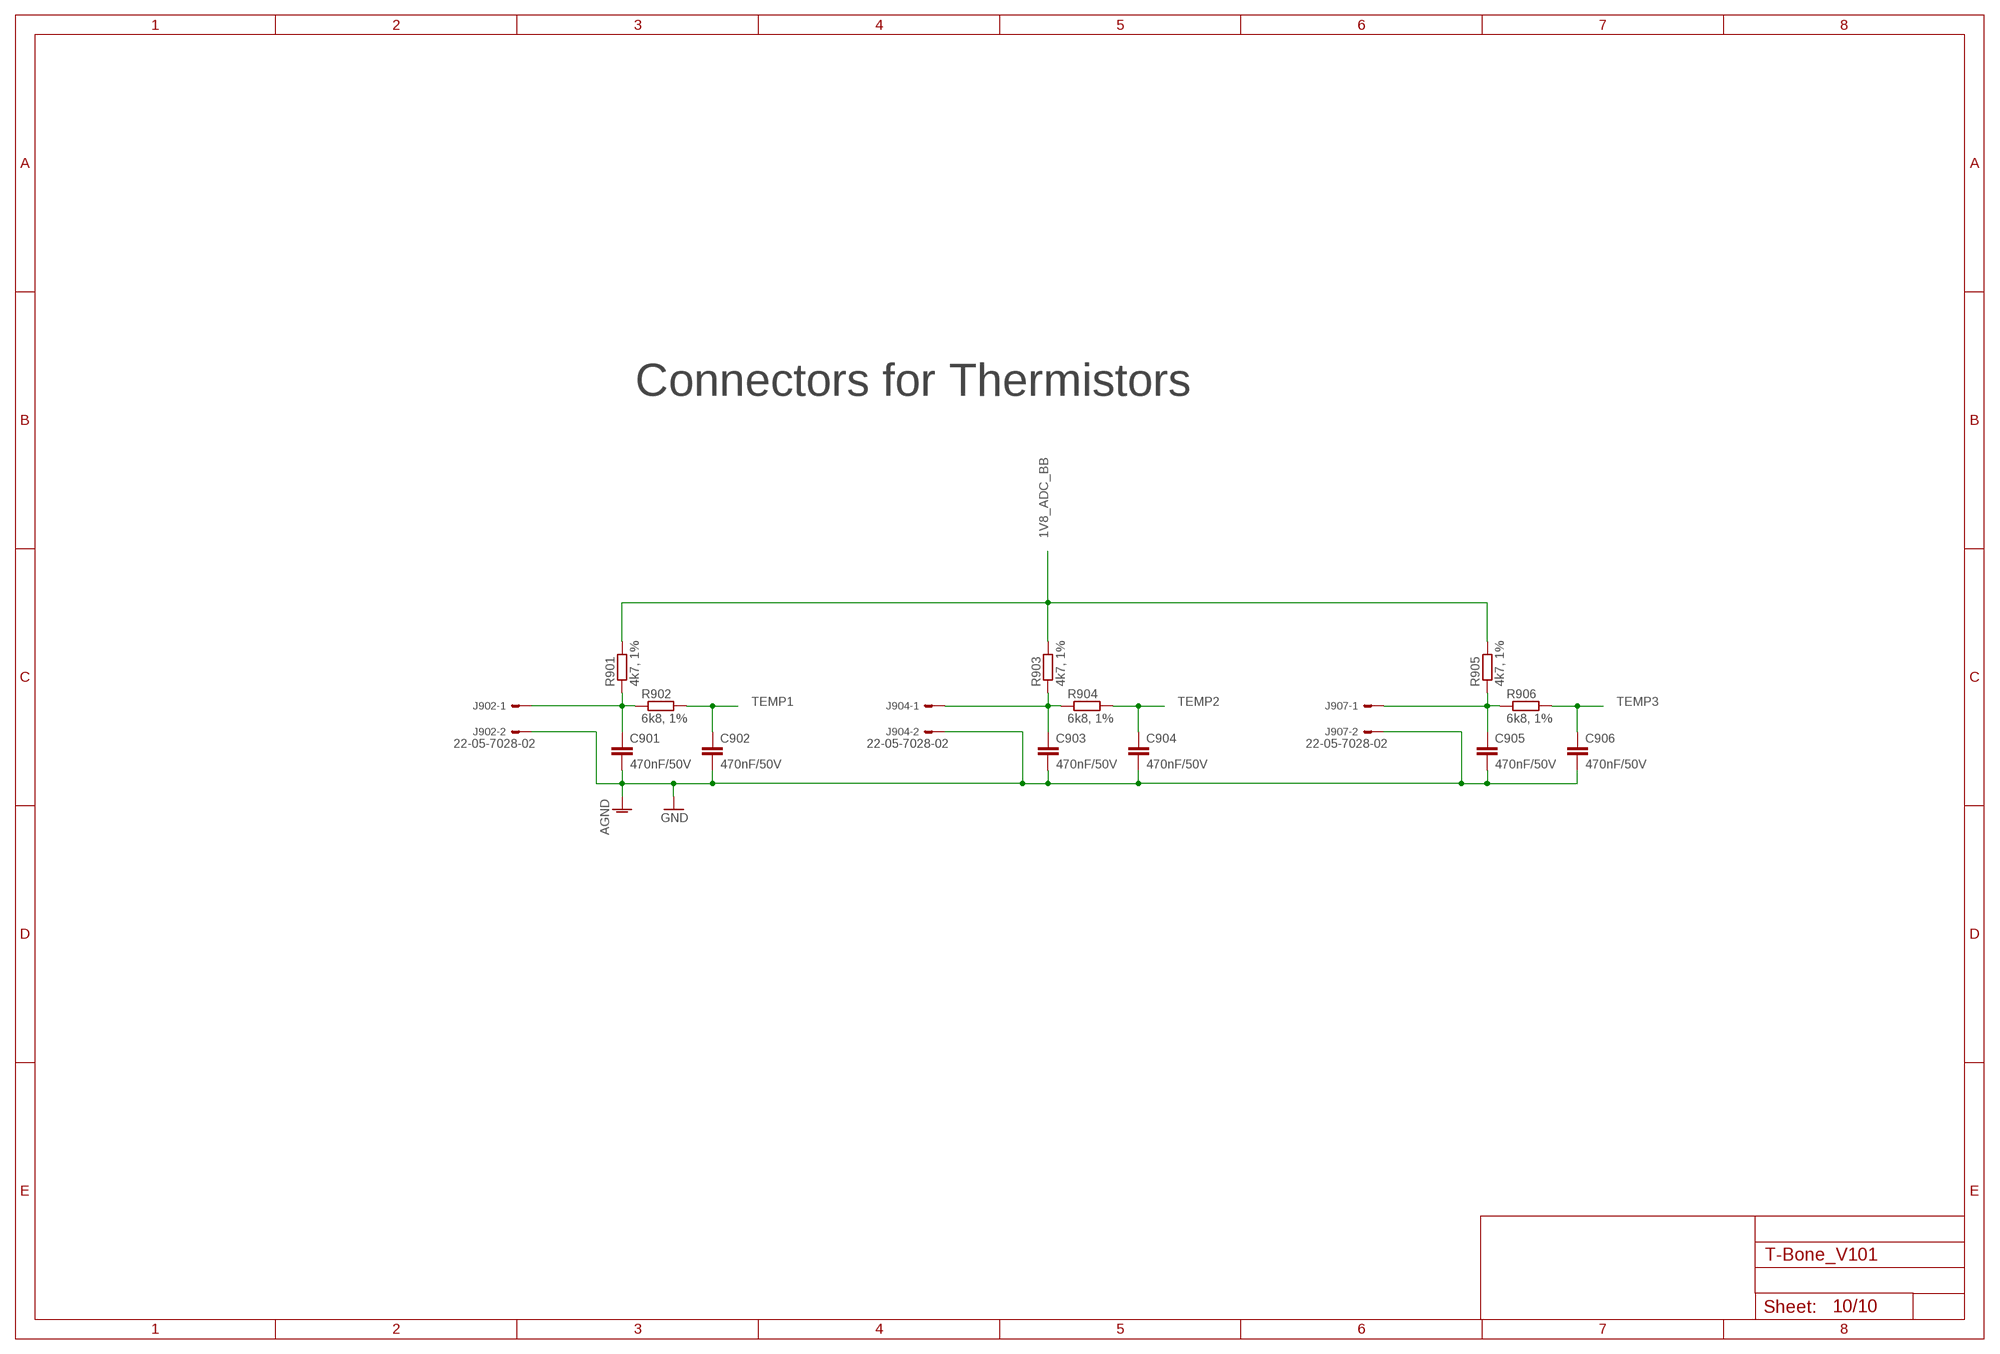
[diagram p9: schematic, sheet 10]

### Parts
C901  470nF/50V  C-EUC0402K  [C0402K]
C902  470nF/50V  C-EUC0402K  [C0402K]
C903  470nF/50V  C-EUC0402K  [C0402K]
C904  470nF/50V  C-EUC0402K  [C0402K]
C905  470nF/50V  C-EUC0402K  [C0402K]
C906  470nF/50V  C-EUC0402K  [C0402K]
J902  22-05-7028-02  [7395-02]
J904  22-05-7028-02  [7395-02]
J907  22-05-7028-02  [7395-02]
R901  4k7, 1%  R-EU_R0402  [R0402]
R902  6k8, 1%  R-EU_R0402  [R0402]
R903  4k7, 1%  R-EU_R0402  [R0402]
R904  6k8, 1%  R-EU_R0402  [R0402]
R905  4k7, 1%  R-EU_R0402  [R0402]
R906  6k8, 1%  R-EU_R0402  [R0402]

### Nets
1V8_ADC_BB: R901.2 R903.2 R905.2 ; also sheet 1,3
GND: C901.2 C902.2 C903.2 C904.2 C905.2 C906.2 J902.2 J904.2 J907.2 ; supply symbol labelled AGND ; also sheet 1,2,3,4,5,6,7,8,9
N$76: C901.1 J902.1 R901.1 R902.1
N$77: C903.1 J904.1 R903.1 R904.1
N$86: C905.1 J907.1 R905.1 R906.1
TEMP1: C902.1 R902.2 ; also sheet 1,3
TEMP2: C904.1 R904.2 ; also sheet 1,3
TEMP3: C906.1 R906.2 ; also sheet 1,3

### Notes on the sheet
- Connectors for Thermistors

## Power pins joined to a net without a drawn wire
UVCC: IC301.2(UVCC)

## Library data of the parts
3V3 GND MISO MOSI RST SCK TP3V3 TP5V TP24V = mylib:TP: test point 1mm round
C101 C201 C202 C204-C210 C301-C305 C401-C406 C409 C410 C501-C511 C601-C611 C701-C711 C802 C804 C901-C906 = rcl:C-EU: CAPACITOR, European symbol
C203 C407 C408 C512 C612 C712 C801 C803 = Jochen_TRI:D8: Panasonic FK Series, D8 Gehäuse
D201 = diode:ZENER-DIODE: Z-Diode
D202 = TMC_3D_Printer:B240A-13-F; DATASHEETURL: http://www.diodes.com/datasheets/ds13004.pdf; IO: 2.0; MANUFACTURER_NAME: Diodes Inc.; MANUFACTURER_PART_NUMBER: B240A-13-F; VENDOR: Diodes Inc.; VFATIO: 0.5; VRRM: 40.0
D401 = Jochen_TRI:MSS1P6: Schottky Diode: 60V
D801 = diode:CGRM400*-G: Molded plasitc,JEDEC SOD-123/Mini SMA Source: Comchip CGRM4001-G.pdf
D802 D804 = mylib:SMBJ48A: Transient Voltage Suppressor
D803 D805 = adafruit:DIODE: Diode SMADIODE - SMA Surface Mount Package 20V 1A Schottky Diode Digikey: 641-1014-6-ND DO-1N4148 - Through Hole Small Current Diode SOD-123 20V 1 A (.5mV Vf) Schottky Diode - Digikey: MBRX120TPMSCT-ND SOD-323 10V 570mA (.38mV Vf, 3ns) Schottky Diode - Digikey: ZLLS410CT-ND SOD-523 30V 30mA Schottky Diode (RB751S-40TE61) - Digikey: RB751S-40TE61CT-ND SOT23-R/W - SOT23 Package (R = Solder Paste/Reflow Ovens, W = Hand-Soldering) BAT54Film 40V 300mA - Digikey: 497-7162-1-ND
END1L_LED END1R_LED END2L_LED END2R_LED END3L_LED END3R_LED END4L_LED END4R_LED END5L_LED END5R_LED FAN_LED LED1_BB LED2_BB LED3_BB LED4_BB POWER_LED PWM1_LED PWM2_LED RX_LED TX_LED = led:LED: LED OSRAM: - CHIPLED LG R971, LG N971, LY N971, LG Q971, LY Q971, LO R971, LY R971 LH N974, LH R974 LS Q976, LO Q976, LY Q976 LO Q996 - Hyper CHIPLED LW Q18S LB Q993, LB Q99A, LB R99A - SideLED LS A670, LO A670, LY A670, LG A670, LP A670 LB A673, LV A673, LT A673, LW A673 LH A674 LY A675 LS A676, LA A676, LO A676, LY A676, LW A676 LS A679, LY A679, LG A679 - Hyper Micro SIDELED® LS Y876, LA Y876, LO Y876, LY Y876 LT Y87S - SmartLED LW L88C, LW L88S LB L89C, LB L89S, LG L890 LS L89K, LO L89K, LY L89K LS L896, LA L896, LO L896, LY L896 - TOPLED LS T670, LO T670, LY T670, LG T670, LP T670 LSG T670, LSP T670, LSY T670, LOP T670, LYG T670 LG T671, LOG T671, LSG T671 LB T673, LV T673, LT T673, LW T673 LH T674 LS T676, LA T676, LO T676, LY T676, LB T676, LH T676, LSB T676, LW T676 LB T67C, LV T67C, LT T67C, LS T67K, LO T67K, LY T67K, LW E67C LS E67B, LA E67B, LO E67B, LY E67B, LB E67C, LV E67C, LT E67C LW T67C LS T679, LY T679, LG T679 LS T770, LO T770, LY T770, LG T770, LP T770 LB T773, LV T773, LT T773, LW T773 LH T774 LS E675, LA E675, LY E675, LS T675 LS T776, LA T776, LO T776, LY T776, LB T776 LHGB T686 LT T68C, LB T68C - Hyper Mini TOPLED® LB M676 - Mini TOPLED Santana® LG M470 LS M47K, LO M47K, LY M47K Source: http://www.osram.convergy.de LUXEON: - LUMILED® LXK2-PW12-R00, LXK2-PW12-S00, LXK2-PW14-U00, LXK2-PW14-V00 LXK2-PM12-R00, LXK2-PM12-S00, LXK2-PM14-U00 LXK2-PE12-Q00, LXK2-PE12-R00, LXK2-PE12-S00, LXK2-PE14-T00, LXK2-PE14-U00 LXK2-PB12-K00, LXK2-PB12-L00, LXK2-PB12-M00, LXK2-PB14-N00, LXK2-PB14-P00, LXK2-PB14-Q00 LXK2-PR12-L00, LXK2-PR12-M00, LXK2-PR14-Q00, LXK2-PR14-R00 LXK2-PD12-Q00, LXK2-PD12-R00, LXK2-PD12-S00 LXK2-PH12-R00, LXK2-PH12-S00 LXK2-PL12-P00, LXK2-PL12-Q00, LXK2-PL12-R00 Source: www.luxeon.com KINGBRIGHT: KA-3528ASYC Source: www.kingbright.com
F201 = fuse:SHK20Q: FUSE HOLDER 5 x 20 mm, SH contact, E1207 Buerklin 64G6061; OC_FARNELL: unknown; OC_NEWARK: unknown
F301 = rcl:L-EU: INDUCTOR, European symbol
IC = TI_Schaltregler:LM25011MY/NOPB; DATASHEETURL: http://www.ti.com/product/lm25011; FREQUENCY: 2000000.0; IMAX: 2.0; MANUFACTURER_NAME: Texas Instruments; MANUFACTURER_PART_NUMBER: LM25011MY/NOPB; MKTG_PACKAGE: NA; NSID: LM25011MY/NOPB; PACKAGE: NA; VENDOR: Texas Instruments
IC101 = microchip:24*: Serial EEPROM I2C; MF: MICROCHIP; MPN: 24LC256-I/SN; OC_FARNELL: 9757996; OC_NEWARK: 27C9144
IC201 = v-reg:LD117A?*: Low drop fixed and adjustable positive voltage regulators 1 A Source: http://www.st.com/stonline/products/literature/ds/7194/ld1117axx.pdf
IC301 = SmartPrj:ATMEGA32U4-XU
IC302 = TMC_3D_Printer:74LVC04A
IC401 = TMC_3D_Printer:TMC-5031-LA: 2-axis Stepper Driver 28V/ 2X1.1A
IC501 IC601 IC701 = TMC_3D_Printer:TMC4361-LI: Single-Axis s-ramp motion controller; ADGPN: 4105361700; MANUFACTURER-1: Trinamic
IC502 IC602 IC702 = TMC_3D_Printer:TMC2660-PA
IC801 IC804 = infineon:BTS428L2: Smart High-Side Power Switch One Channel: 60mOhm Status Feedback Source: Source: www.infineon.com .. BTS428L2_20030912.pdf; OC_FARNELL: unknown; OC_NEWARK: unknown
IC802 = TMC_3D_Printer:74LVC32A
IC803 = TMC_3D_Printer:74LVC02A
J101 J450 J460 J470 J480 J550 J560 J650 J660 J750 J760 = TMC_3D_Printer:22-?-03: CONNECTOR wire to board 2.54 mm (.1 inch) pitch header; OC_FARNELL: unknown; OC_NEWARK: unknown
J401 J402 J502 J602 J702 = TMC_3D_Printer:22-?-04: CONNECTOR wire to board 2.54 mm (.1 inch) pitch header; OC_FARNELL: unknown; OC_NEWARK: unknown
J501 J601 J701 = TMC_3D_Printer:22-?-05: CONNECTOR wire to board 2.54 mm (.1 inch) pitch header; OC_FARNELL: unknown; OC_NEWARK: unknown
J801 J902 J904 J907 = TMC_3D_Printer:22-?-02: CONNECTOR wire to board 2.54 mm (.1 inch) pitch header; OC_FARNELL: 9731601; OC_NEWARK: unknown
L201 = Schaltregler_24V_5V_1.2A:SDR0805-120ML; DCR: 0.08; IDC: 2.0; L: 1.2E-5; MANUFACTURER_NAME: Bourns; MANUFACTURER_PART_NUMBER: SDR0805-120ML; VENDOR: Bourns
L301 = wuerth-elektronik:WE-CBF: SMD EMI Suppression Ferrite Beads - excellent anti-EMI properties - low DCR - impedances till 3000 ohms - rated current up to 6 A
P8 P9 = TMC_3D_Printer:PINHD-2X23: PIN HEADER
Q301 = crystal:CSM-7X-DU: SMD CRYSTAL Source: www.ecsxtal.com .. Crystal 3.6864MHz CSM_7X_DU.PDF; OC_FARNELL: unknown; OC_NEWARK: unknown
Q801 = TMC_3D_Printer:AO7400
Q802 Q803 = transistor-small-signal:BSS123: N-CHANNEL MOS FET
R1 R2 R101-R103 R105-R108 R201-R204 R301-R304 R401-R407 R450-R452 R460-R462 R470-R472 R480-R482 R501-R507 R550-R552 R560-R562 R601-R607 R650-R652 R660-R662 R701-R707 R750-R752 R760-R762 R801 R802 R804-R808 R810-R813 R901-R906 = rcl:R-EU_: RESISTOR, European symbol
R803 R809 = varistor:S10K40: VARISTOR
RN101 RN301 = resistor-dil:4R-N: Array Chip Resistor Source: RS Component / Phycomp; OC_FARNELL: unknown; OC_NEWARK: unknown
SJ1 SJ2 = jumper:SJ: SMD solder JUMPER
SJ3 SJ4 SJ450 SJ460 SJ470 SJ480 SJ550 SJ560 SJ650 SJ660 SJ750 SJ760 = jumper:SJ2W: SMD solder JUMPER
U$301 = SmartPrj:TS42: TS42 Dongnan Electronics Tact switch VDC 12V - 50mA
U$501 U$601 U$701 = sn74lvc3g17-sm8:SN74LVC3G17-SM8
X1 = con-cypressindustries:MINI-USB-SCHIELD-: MINI USB-B Conector Source: www.cypressindustries.com; OC_FARNELL: unknown; OC_NEWARK: unknown
X201 = TMC_3D_Printer:MSTBA4: PHOENIX; MF: FARNELL; MPN: 1757268; OC_FARNELL: 3705195; OC_NEWARK: 71C4163
X801 X802 = TMC_3D_Printer:MSTBA2: PHOENIX; MF: FARNELL; MPN: 1757242; OC_FARNELL: 3705171; OC_NEWARK: 71C4161

## Net classes
1 coil_current: width 0.254 mm, drill 1.2 mm, clearance 0.254 mm